# EAGLE design system (EAGLE 9.6.2)
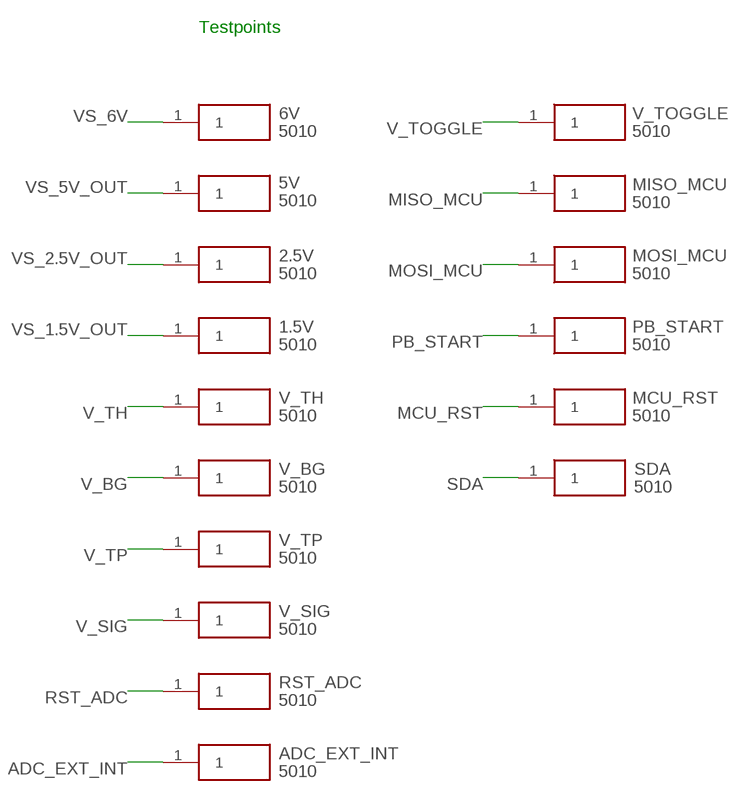
[diagram p0: schematic, sheet 1, part 1 of 2]
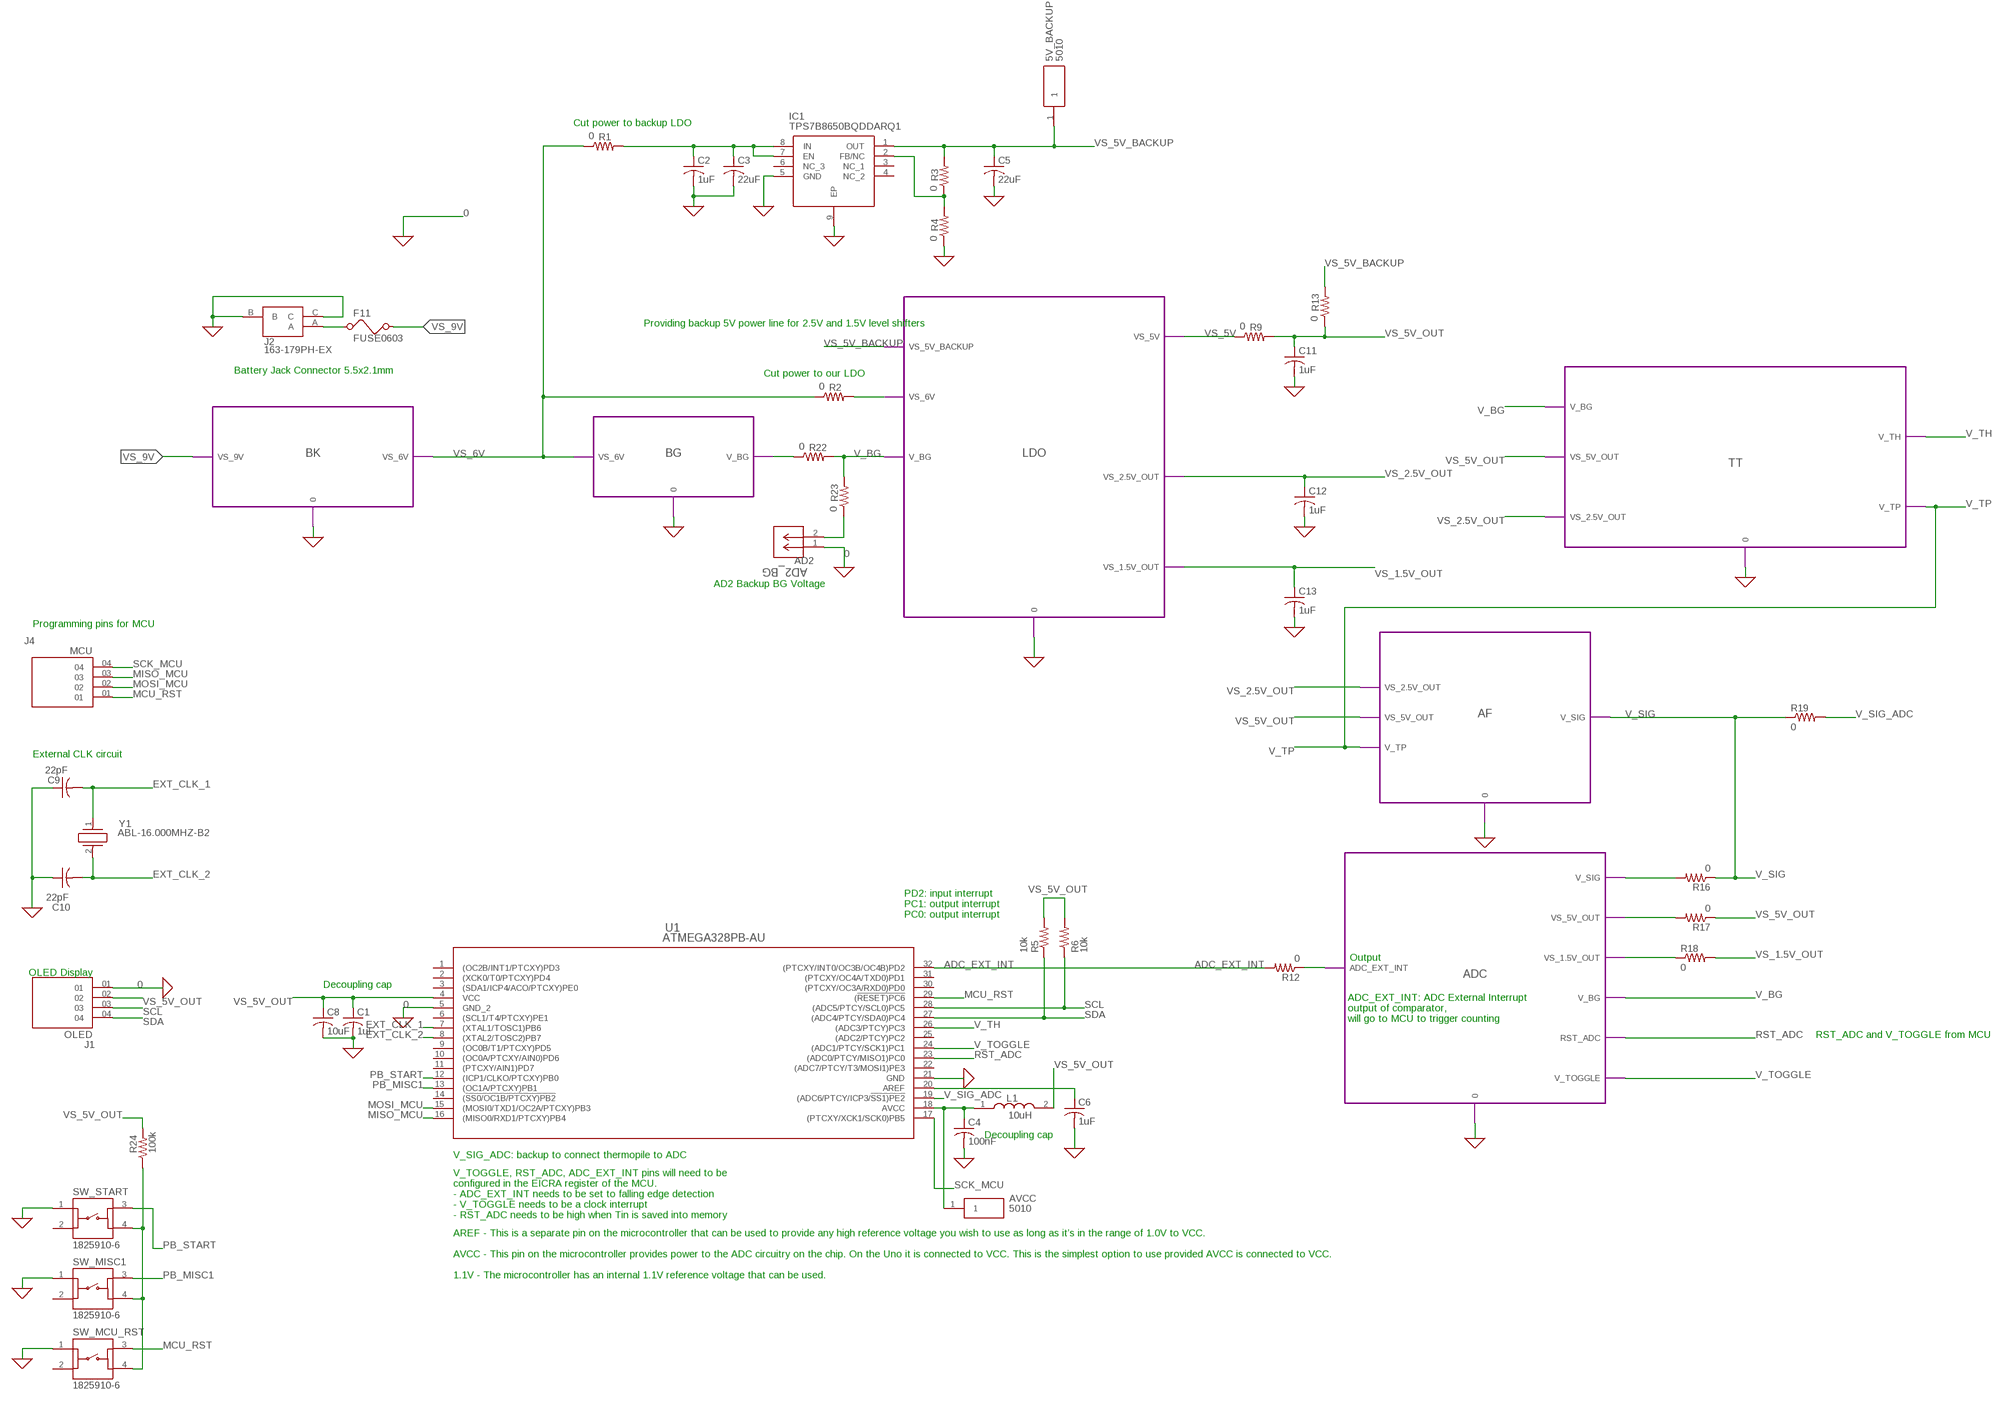
[diagram p1: schematic, sheet 1, part 2 of 2]

## Parts
1.5V  5010  [5010]
2.5V  5010  [5010]
5V  5010  [5010]
5V_BACKUP  5010  [5010]
6V  5010  [5010]
AD2_BG  AD2_BG  RS1-02-G  [CONN_RS1-02-G_ADM]
ADC_EXT_INT  5010  [5010]
AVCC  5010  [5010]
C1  1uF  C-USC0603  [C0603]
C2  1uF  C-USC0603  [C0603]
C3  22uF  C-USC0603  [C0603]
C4  100nF  C-USC0603  [C0603]
C5  22uF  C-USC0603  [C0603]
C6  1uF  C-USC0603  [C0603]
C8  10uF  C-USC0603  [C0603]
C9  22pF  C-USC0603  [C0603]
C10  22pF  C-USC0603  [C0603]
C11  1uF  C-USC0603  [C0603]
C12  1uF  C-USC0603  [C0603]
C13  1uF  C-USC0603  [C0603]
F11  FUSE0603  [R0603]
IC1  TPS7B8650BQDDARQ1  [SOIC127P600X170-9N]
J1  OLED  TSW-104-07-F-S  [SAMTEC_TSW-104-07-F-S]
J2  163-179PH-EX  [163179PHEX]
J4  MCU  TSW-104-07-F-S  [SAMTEC_TSW-104-07-F-S]
L1  10uH  SRP1038CC-100M  [INDPM110100X400N]
MCU_RST  5010  [5010]
MISO_MCU  5010  [5010]
MOSI_MCU  5010  [5010]
PB_START  5010  [5010]
R1  0  R-US_R0603  [R0603]
R2  0  R-US_R0603  [R0603]
R3  0  R-US_R0603  [R0603]
R4  0  R-US_R0603  [R0603]
R5  10k  R-US_R0603  [R0603]
R6  10k  R-US_R0603  [R0603]
R9  0  R-US_R0603  [R0603]
R12  0  R-US_R0603  [R0603]
R13  0  R-US_R0603  [R0603]
R16  0  R-US_R0603  [R0603]
R17  0  R-US_R0603  [R0603]
R18  0  R-US_R0603  [R0603]
R19  0  R-US_R0603  [R0603]
R22  0  R-US_R0603  [R0603]
R23  0  R-US_R0603  [R0603]
R24  100k  R-US_R0603  [R0603]
RST_ADC  5010  [5010]
SDA  5010  [5010]
SW_MCU_RST  1825910-6  [SW_1825910-6-4]
SW_MISC1  1825910-6  [SW_1825910-6-4]
SW_START  1825910-6  [SW_1825910-6-4]
U1  ATMEGA328PB-AU  [32A_MCH]
V_BG  5010  [5010]
V_SIG  5010  [5010]
V_TH  5010  [5010]
V_TOGGLE  5010  [5010]
V_TP  5010  [5010]
Y1  ABL-16.000MHZ-B2  [ABL]

## Module instances
BK = BATTERY_AND_BUCK
LDO = LDO_AND_VOLTAGE_REFS
BG = BANDGAP_REF
TT = THERMISTOR_THERMOPILE
AF = AMP_AND_FILTER
ADC = DUAL_SLOPE_ADC

## Nets
0: AD2_BG.1 C1.2 C2.2 C3.2 C4.2 C5.2 C6.2 C8.2 C9.1 C10.1 C11.2 C12.2 C13.2 IC1.5(GND) IC1.9(EP) J1.01 J2.B J2.C R4.1 SW_MCU_RST.1 SW_MISC1.1 SW_START.1 U1.5(GND_2) U1.21(GND) ; port TT.0 AF.0 ADC.0 BG.0 BK.0 LDO.0 ; supply symbol labelled GND
ADC_EXT_INT: ADC_EXT_INT.1 R12.2 U1.32((PTCXY/INT0/OC3B/OC4B)PD2)
EXT_CLK_1: C9.2 U1.7((XTAL1/TOSC1)PB6) Y1.1
EXT_CLK_2: C10.2 U1.8((XTAL2/TOSC2)PB7) Y1.2
MCU_RST: J4.01 MCU_RST.1 SW_MCU_RST.3 U1.29((!RESET)PC6)
MISO_MCU: J4.03 MISO_MCU.1 U1.16((MISO0/RXD1/PTCXY)PB4)
MOSI_MCU: J4.02 MOSI_MCU.1 U1.15((MOSI0/TXD1/OC2A/PTCXY)PB3)
N$1: R2.2 ; port LDO.VS_6V
N$2: R16.2 ; port ADC.V_SIG
N$3: F11.1 J2.A
N$4: AVCC.1 C4.1 L1.1 U1.18(AVCC)
N$5: R18.1 ; port ADC.VS_1.5V_OUT
N$6: R17.2 ; port ADC.VS_5V_OUT
N$7: R22.1 ; port BG.V_BG
N$9: C2.1 C3.1 IC1.7(EN) IC1.8(IN) R1.2
N$10: IC1.2(FB/NC) R3.1 R4.2
N$11: AD2_BG.2 R23.1
N$14: R12.1 ; port ADC.ADC_EXT_INT
N$15: C6.1 U1.20(AREF)
N$19: R24.1 SW_MCU_RST.4 SW_MISC1.4 SW_START.4
PB_MISC1: SW_MISC1.3 U1.13((OC1A/PTCXY)PB1)
PB_START: PB_START.1 SW_START.3 U1.12((ICP1/CLKO/PTCXY)PB0)
RST_ADC: RST_ADC.1 U1.23((ADC0/PTCY/MISO1)PC0) ; port ADC.RST_ADC
SCK_MCU: J4.04 U1.17((PTCXY/XCK1/SCK0)PB5)
SCL: J1.03 R6.1 U1.28((ADC5/PTCY/SCL0)PC5)
SDA: J1.04 R5.1 SDA.1 U1.27((ADC4/PTCY/SDA0)PC4)
V_BG: R22.2 R23.2 V_BG.1 ; port LDO.V_BG TT.V_BG ADC.V_BG
V_SIG: R16.1 R19.1 V_SIG.1 ; port AF.V_SIG
V_SIG_ADC: R19.2 U1.19((ADC6/PTCY/ICP3/!SS1)PE2)
V_TH: U1.26((ADC3/PTCY)PC3) V_TH.1 ; port TT.V_TH
V_TOGGLE: U1.24((ADC1/PTCY/SCK1)PC1) V_TOGGLE.1 ; port ADC.V_TOGGLE
V_TP: V_TP.1 ; port AF.V_TP TT.V_TP
VS_1.5V_OUT: 1.5V.1 C13.1 R18.2 ; port LDO.VS_1.5V_OUT
VS_2.5V_OUT: 2.5V.1 C12.1 ; port LDO.VS_2.5V_OUT AF.VS_2.5V_OUT TT.VS_2.5V_OUT
VS_5V: R9.1 ; port LDO.VS_5V
VS_5V_BACKUP: 5V_BACKUP.1 C5.1 IC1.1(OUT) R3.2 R13.2 ; port LDO.VS_5V_BACKUP
VS_5V_OUT: 5V.1 C1.1 C8.1 C11.1 J1.02 L1.2 R5.2 R6.2 R9.2 R13.1 R17.1 R24.2 U1.4(VCC) ; port AF.VS_5V_OUT TT.VS_5V_OUT
VS_6V: 6V.1 R1.1 R2.1 ; port BK.VS_6V BG.VS_6V
VS_9V: F11.2 ; port BK.VS_9V
Unconnected: IC1.3(NC_1) IC1.4(NC_2) IC1.6(NC_3) SW_MCU_RST.2 SW_MISC1.2 SW_START.2 U1.1((OC2B/INT1/PTCXY)PD3) U1.2((XCK0/T0/PTCXY)PD4) U1.3((SDA1/ICP4/ACO/PTCXY)PE0) U1.6((SCL1/T4/PTCXY)PE1) U1.9((OC0B/T1/PTCXY)PD5) U1.10((OC0A/PTCXY/AIN0)PD6) U1.11((PTCXY/AIN1)PD7) U1.14((!SS0/OC1B/PTCXY)PB2) U1.22((ADC7/PTCY/T3/MOSI1)PE3) U1.25((ADC2/PTCY)PC2) U1.30((PTCXY/OC3A/RXD0)PD0) U1.31((PTCXY/OC4A/TXD0)PD1)

## Notes on the sheet
- Cut power to backup LDO
- Providing backup 5V power line for 2.5V and 1.5V level shifters
- Battery Jack Connector 5.5x2.1mm
- Cut power to our LDO
- AD2 Backup BG Voltage
- Programming pins for MCU
- Testpoints
- External CLK circuit
- PD2: input interrupt 
  PC1: output interrupt
  PC0: output interrupt
- Output
- OLED Display
- Decoupling cap
- ADC_EXT_INT: ADC External Interrupt
  output of comparator, 
  will go to MCU to trigger counting
- RST_ADC and V_TOGGLE from MCU
- Decoupling cap
- V_SIG_ADC: backup to connect thermopile to ADC
- V_TOGGLE, RST_ADC, ADC_EXT_INT pins will need to be 
  configured in the EICRA register of the MCU. 
  - ADC_EXT_INT needs to be set to falling edge detection
  - V_TOGGLE needs to be a clock interrupt
  - RST_ADC needs to be high when Tin is saved into memory
- AREF - This is a separate pin on the microcontroller that can be used to provide any high reference voltage you wish to use as long as it’s in the range of 1.0V to VCC. 
  
  AVCC - This pin on the microcontroller provides power to the ADC circuitry on the chip. On the Uno it is connected to VCC. This is the simplest option to use provided AVCC is connected to VCC. 
  
  1.1V - The microcontroller has an internal 1.1V reference voltage that can be used.

## Library data of the parts
1.5V 2.5V 5V 5V_BACKUP 6V ADC_EXT_INT AVCC MCU_RST MISO_MCU MOSI_MCU PB_START RST_ADC SDA V_BG V_SIG V_TH V_TOGGLE V_TP = 5010:5010: KEYSTONE - 5010 - TEST POINT, PCB, THROUGH HOLE Source: Datasheet; DESCRIPTION: KEYSTONE - 5010 - TEST POINT, PCB, THROUGH HOLE; HEIGHT: 8.28mm; MANUFACTURER_NAME: Keystone Electronics; MANUFACTURER_PART_NUMBER: 5010; MOUSER_PART_NUMBER: 534-5010; MOUSER_PRICE-STOCK: https://www.mouser.co.uk/ProductDetail/Keystone-Electronics/5010?qs=qOqV1E1P08SzD%252BWfk1wMXQ%3D%3D
AD2_BG = RS1-02-G:RS1-02-G; AD2: AD2; COPYRIGHT: Copyright (C) 2024 Ultra Librarian. All rights reserved.; MANUFACTURER_PART_NUMBER: RS1-02-G; MFR_NAME: ADAM TECHNOLOGIES INC
C1-C6 C8-C13 = rcl:C-US: CAPACITOR, American symbol; SPICEPREFIX: C
F11 = Fuse_Custom:FUSE0603
IC1 = TPS7B8650BQDDARQ1:TPS7B8650BQDDARQ1: LDO Voltage Regulators Automotive 500-mA, 40-V, ultra-low-IQ, low-dropout (LDO) linear regulator with power good 8-SO PowerPAD -40 to 150 Source: Datasheet <https://www.ti.com/lit/gpn/tps7b86-q1?HQS=ti-null-null-sf-df-pf-sep-wwe&DCM=yes?hkey=EF798316E3902B6ED9A73243A3159BB0>; DESCRIPTION: LDO Voltage Regulators Automotive 500-mA, 40-V, ultra-low-IQ, low-dropout (LDO) linear regulator with power good 8-SO PowerPAD -40 to 150; HEIGHT: 1.7mm; MANUFACTURER_NAME: Texas Instruments; MANUFACTURER_PART_NUMBER: TPS7B8650BQDDARQ1; MOUSER_PART_NUMBER: 595-PS7B8650BQDDARQ1; MOUSER_PRICE-STOCK: https://www.mouser.co.uk/ProductDetail/Texas-Instruments/TPS7B8650BQDDARQ1?qs=ulEaXIWI0c8l2EN1AjsVkA%3D%3D
J1 J4 = TSW-104-07-F-S:TSW-104-07-F-S; MANUFACTURER: Samtec; PARTREV: R; STANDARD: Manufacturer Recommendations
J2 = 163-179PH-EX:163-179PH-EX: DC Power Connectors PCB 2.1MM Source: Datasheet <https://componentsearchengine.com/Datasheets/1/163-179PH-EX.pdf>; DESCRIPTION: DC Power Connectors PCB 2.1MM; HEIGHT: 11mm; MANUFACTURER_NAME: Kobiconn; MANUFACTURER_PART_NUMBER: 163-179PH-EX; MOUSER_PART_NUMBER: 163-179PH-EX; MOUSER_PRICE-STOCK: https://www.mouser.co.uk/ProductDetail/Kobiconn/163-179PH-EX?qs=Xb8IjHhkxj5l2UOaIqcGCw%3D%3D
L1 = SRP1038CC-100M:SRP1038CC-100M: Ind,11x10x3.8mm,10uH+/-20%,8.5A,shd Source: Datasheet <https://www.bourns.com/docs/Product-Datasheets/SRP1038CC.pdf>; DESCRIPTION: Ind,11x10x3.8mm,10uH+/-20%,8.5A,shd; HEIGHT: 4mm; MANUFACTURER_NAME: Bourns; MANUFACTURER_PART_NUMBER: SRP1038CC-100M; MOUSER_PART_NUMBER: 652-SRP1038CC-100M; MOUSER_PRICE-STOCK: https://www.mouser.co.uk/ProductDetail/Bourns/SRP1038CC-100M?qs=1Kr7Jg1SGW%252BXHFZ7Gpw7DQ%3D%3D
R1-R6 R9 R12 R13 R16-R19 R22-R24 = rcl:R-US_: RESISTOR, American symbol; SPICEPREFIX: R
SW_MCU_RST SW_MISC1 SW_START = 1825910-6:1825910-6: Switch Tactile OFF (ON) SPST Round Button PC Pins 0.05A 24VDC 100000Cycles 1.57N Thru-Hole Loose Check availability <https://pricing.snapeda.com/parts/1825910-6/TE%20Connectivity/view-part?ref=eda>; AVAILABILITY: In Stock; CHECK_PRICES: https://www.snapeda.com/parts/1825910-6/TE+Connectivity+ALCOSWITCH+Switches/view-part/?ref=eda; COMMENT: 1825910-6; DESCRIPTION: Switch Push Button OFF (ON) SPST Round Button 0.05A 24VDC Momentary Contact PC Pins Thru-Hole; MF: TE Connectivity; MP: 1825910-6; PACKAGE: None; PRICE: None; SNAPEDA_LINK: https://www.snapeda.com/parts/1825910-6/TE+Connectivity+ALCOSWITCH+Switches/view-part/?ref=snap
U1 = ATMEGA328PB_AU32A:ATMEGA328PB-AU; COPYRIGHT: Copyright (C) 2024 Ultra Librarian. All rights reserved.; MANUFACTURER_PART_NUMBER: ATMEGA328PB-AU; MFR_NAME: Microchip
Y1 = ABL-16.000MHZ-B2:ABL-16.000MHZ-B2: ABRACON - ABL-16.000MHZ-B2 - CRYSTAL Source: Datasheet <https://abracon.com/Resonators/ABL.pdf>; DESCRIPTION: ABRACON - ABL-16.000MHZ-B2 - CRYSTAL; HEIGHT: mm; MANUFACTURER_NAME: ABRACON; MANUFACTURER_PART_NUMBER: ABL-16.000MHZ-B2; MOUSER_PART_NUMBER: 815-ABL-16-B2; MOUSER_PRICE-STOCK: https://www.mouser.co.uk/ProductDetail/ABRACON/ABL-16.000MHZ-B2?qs=A7YjigRBFZlH19Ss3q%252BAbA%3D%3D

## Module BATTERY_AND_BUCK
Ports: VS_6V(io) VS_9V(io) 0(io)
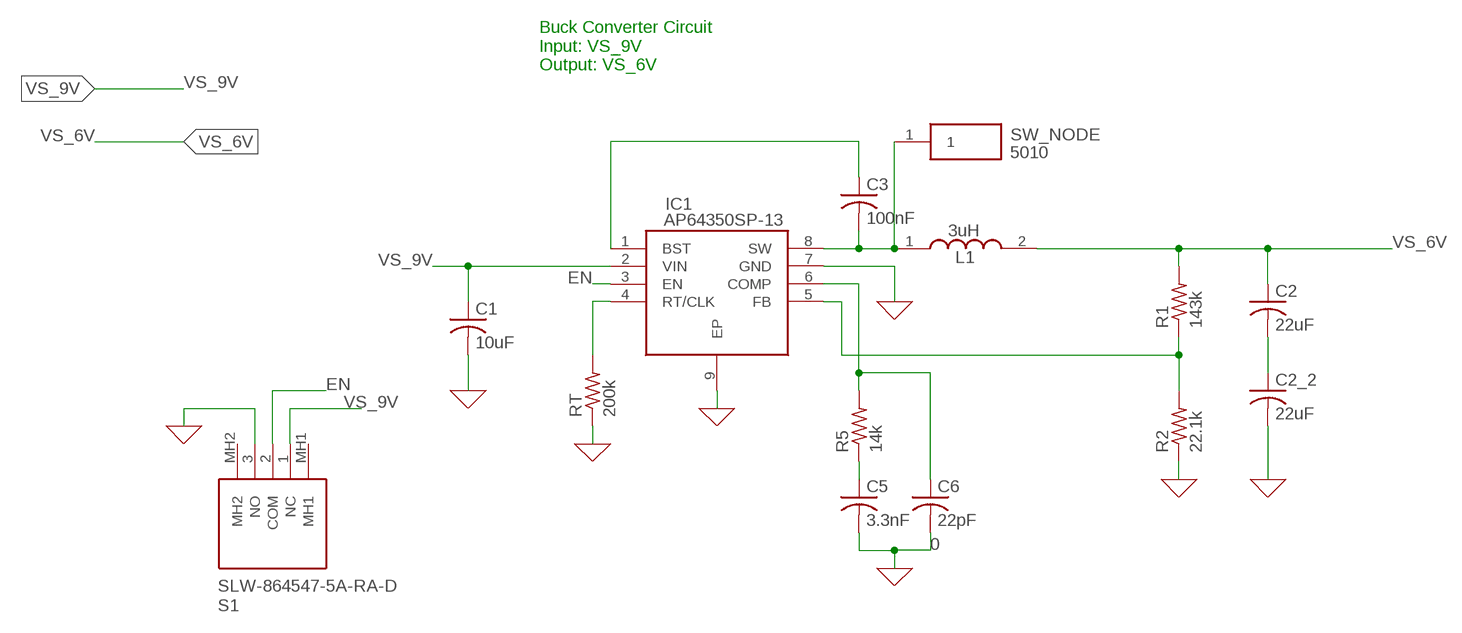
[diagram p2: schematic, module BATTERY_AND_BUCK, sheet 1]

### Parts
C1  10uF  C-USC0603  [C0603]
C2  22uF  C-USC0603  [C0603]
C2_2  22uF  C-USC0603  [C0603]
C3  100nF  C-USC0603  [C0603]
C5  3.3nF  C-USC0603  [C0603]
C6  22pF  C-USC0603  [C0603]
IC1  AP64350SP-13  [SOIC127P600X163-9N]
L1  3uH  744053003  [WE-TPC_5818/582892]
R1  143k  R-US_R0603  [R0603]
R2  22.1k  R-US_R0603  [R0603]
R5  14k  R-US_R0603  [R0603]
RT  200k  R-US_R0603  [R0603]
S1  SLW-864547-5A-RA-D  [SLW8645475ARAD]
SW_NODE  5010  [5010]

### Nets
0: C1.2 C2_2.2 C5.2 C6.2 IC1.7(GND) IC1.9(EP) R2.1 RT.1 S1.3(NO) ; supply symbol labelled GND
EN: IC1.3(EN) S1.2(COM)
N$1: IC1.4(RT/CLK) RT.2
N$2: C3.2 IC1.8(SW) L1.1 SW_NODE.1
N$3: C3.1 IC1.1(BST)
N$4: C2.2 C2_2.1
N$5: C6.1 IC1.6(COMP) R5.2
N$6: IC1.5(FB) R1.1 R2.2
N$7: C5.1 R5.1
VS_6V: C2.1 L1.2 R1.2
VS_9V: C1.1 IC1.2(VIN) S1.1(NC)
Unconnected: S1.MH1 S1.MH2

### Notes on the sheet
- Buck Converter Circuit
  Input: VS_9V
  Output: VS_6V

### Library data of the parts
C1 C2 C2_2 C3 C5 C6 = rcl:C-US: CAPACITOR, American symbol; SPICEPREFIX: C
IC1 = AP64350SP-13:AP64350SP-13: Switching Voltage Regulators 3.8V-40V 3.5A LOW IQ SYN BUCK PRG SW FRQ Source: Datasheet <https://www.diodes.com//assets/Datasheets/AP64350.pdf>; DESCRIPTION: Switching Voltage Regulators 3.8V-40V 3.5A LOW IQ SYN BUCK PRG SW FRQ; HEIGHT: 1.63mm; MANUFACTURER_NAME: Diodes Incorporated; MANUFACTURER_PART_NUMBER: AP64350SP-13; MOUSER_PART_NUMBER: 621-AP64350SP-13; MOUSER_PRICE-STOCK: https://www.mouser.co.uk/ProductDetail/Diodes-Incorporated/AP64350SP-13?qs=P1JMDcb91o71f8WTy9mMPQ%3D%3D
L1 = 744053003:744053003: Wurth Shielded Wire-wound SMD Inductor with a Ferrite Core, 3 uH +/-30% 2.8A Idc Source: Datasheet <https://componentsearchengine.com/Datasheets/1/744053003.pdf>; DESCRIPTION: Wurth Shielded Wire-wound SMD Inductor with a Ferrite Core, 3 uH +/-30% 2.8A Idc; HEIGHT: mm; MANUFACTURER_NAME: Wurth Elektronik; MANUFACTURER_PART_NUMBER: 744053003; MOUSER_PART_NUMBER: 710-744053003; MOUSER_PRICE-STOCK: https://www.mouser.com/Search/Refine.aspx?Keyword=710-744053003
R1 R2 R5 RT = rcl:R-US_: RESISTOR, American symbol; SPICEPREFIX: R
S1 = SLW-864547-5A-RA-D:SLW-864547-5A-RA-D: 8.6 x 4.5 x 4.7 mm, 5 mm Raised Slide Actuator, Right Angle, Through Hole, Slide Switch Source: Datasheet <https://www.cuidevices.com/product/resource/slw-864547-5a-ra-d.pdf>; DESCRIPTION: 8.6 x 4.5 x 4.7 mm, 5 mm Raised Slide Actuator, Right Angle, Through Hole, Slide Switch; HEIGHT: 4.9mm; MANUFACTURER_NAME: CUI Devices; MANUFACTURER_PART_NUMBER: SLW-864547-5A-RA-D; MOUSER_PART_NUMBER: 179-SLW-864547-5ARAD; MOUSER_PRICE-STOCK: https://www.mouser.co.uk/ProductDetail/CUI-Devices/SLW-864547-5A-RA-D?qs=1Kr7Jg1SGW%252Bn%2FarYZIP3WQ%3D%3D
SW_NODE = 5010:5010: KEYSTONE - 5010 - TEST POINT, PCB, THROUGH HOLE Source: Datasheet; DESCRIPTION: KEYSTONE - 5010 - TEST POINT, PCB, THROUGH HOLE; HEIGHT: 8.28mm; MANUFACTURER_NAME: Keystone Electronics; MANUFACTURER_PART_NUMBER: 5010; MOUSER_PART_NUMBER: 534-5010; MOUSER_PRICE-STOCK: https://www.mouser.co.uk/ProductDetail/Keystone-Electronics/5010?qs=qOqV1E1P08SzD%252BWfk1wMXQ%3D%3D

## Module LDO_AND_VOLTAGE_REFS
Ports: VS_6V(io) V_BG(io) VS_5V(io) VS_5V_BACKUP(io) VS_2.5V_OUT(io) VS_1.5V_OUT(io) 0(io)
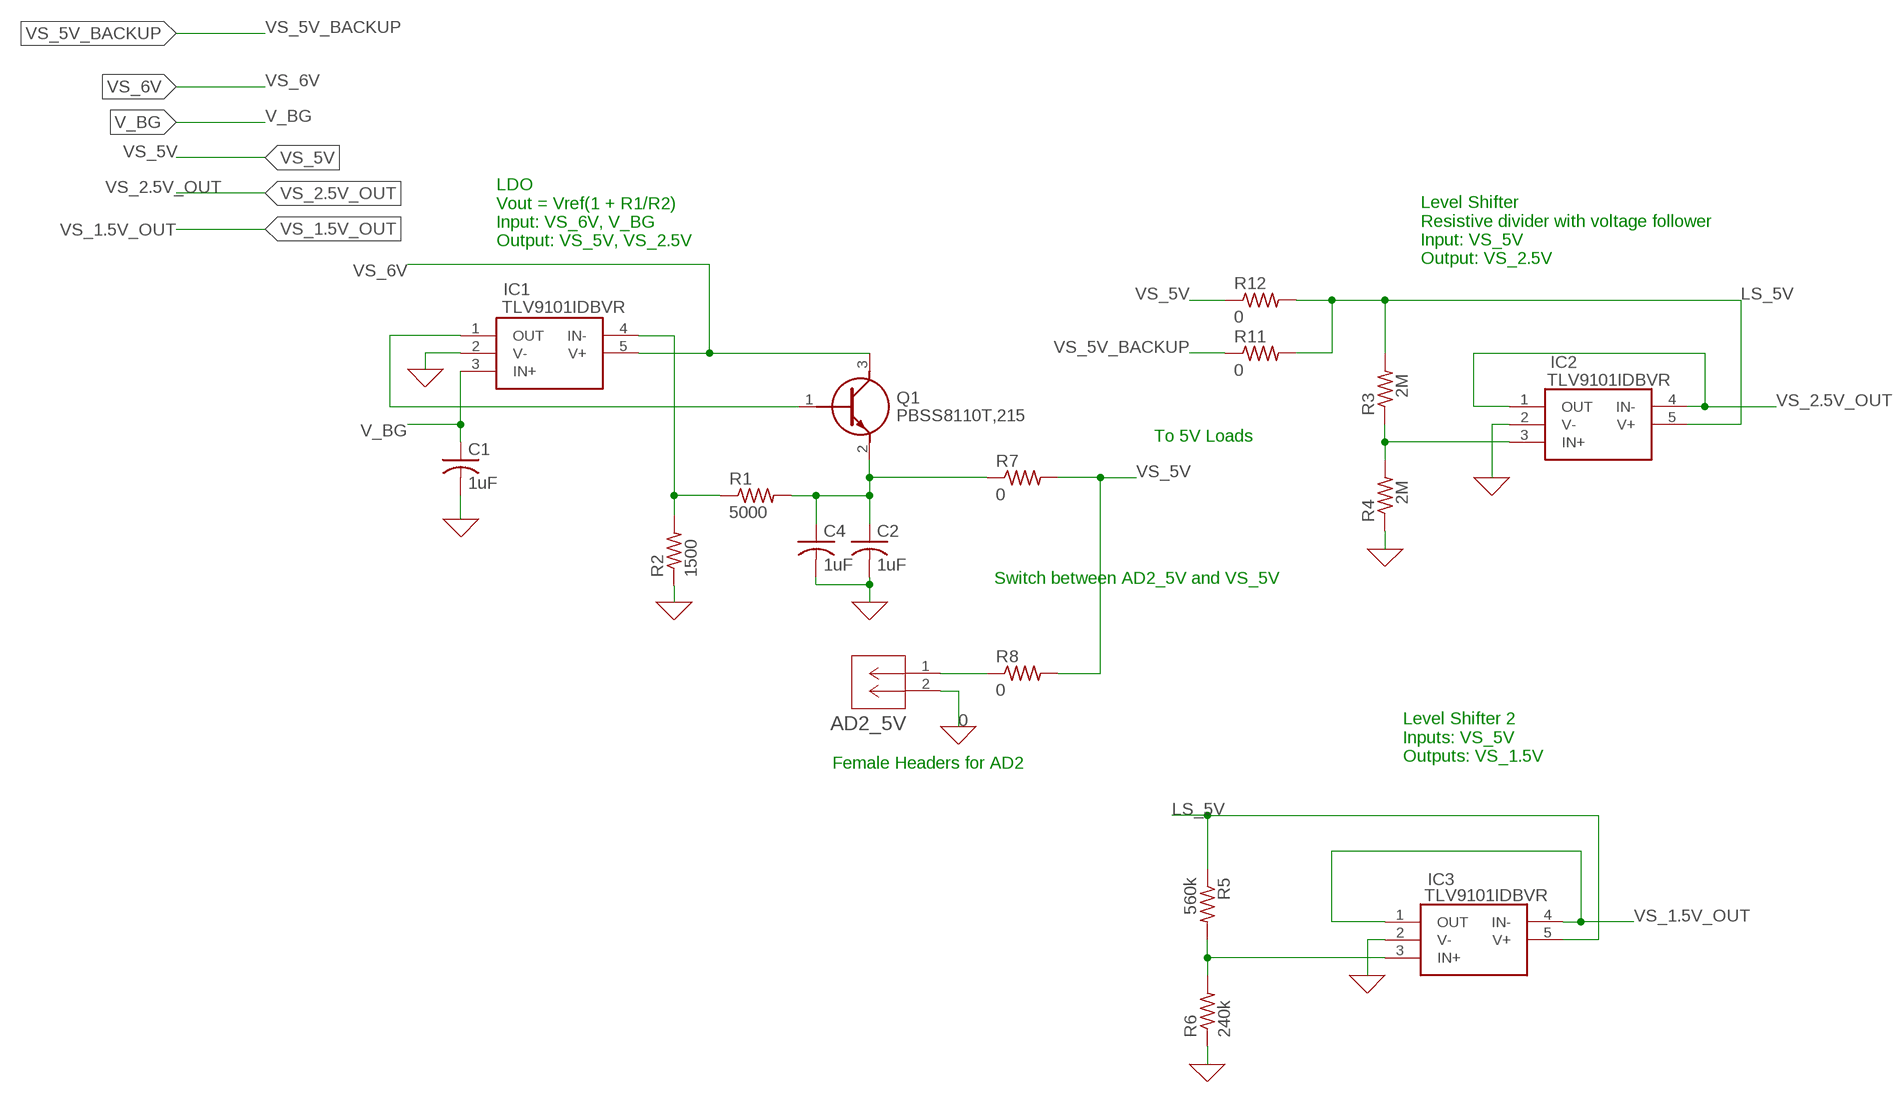
[diagram p3: schematic, module LDO_AND_VOLTAGE_REFS, sheet 1]

### Parts
AD2_5V  RS1-02-G  [CONN_RS1-02-G_ADM]
C1  1uF  C-USC0603  [C0603]
C2  1uF  C-USC0603  [C0603]
C4  1uF  C-USC0603  [C0603]
IC1  TLV9101IDBVR  [SOT95P280X145-5N]
IC2  TLV9101IDBVR  [SOT95P280X145-5N]
IC3  TLV9101IDBVR  [SOT95P280X145-5N]
Q1  PBSS8110T,215  [SOT95P230X110-3N]
R1  5000  R-US_R0603  [R0603]
R2  1500  R-US_R0603  [R0603]
R3  2M  R-US_R0603  [R0603]
R4  2M  R-US_R0603  [R0603]
R5  560k  R-US_R0603  [R0603]
R6  240k  R-US_R0603  [R0603]
R7  0  R-US_R0603  [R0603]
R8  0  R-US_R0603  [R0603]
R11  0  R-US_R0603  [R0603]
R12  0  R-US_R0603  [R0603]

### Nets
0: AD2_5V.2 C1.2 C2.2 C4.2 IC1.2(V-) IC2.2(V-) IC3.2(V-) R2.1 R4.1 R6.1 ; supply symbol labelled GND
LS_5V: IC2.5(V+) IC3.5(V+) R3.2 R5.1 R11.2 R12.2
N$1: IC1.4(IN-) R1.1 R2.2
N$2: IC2.3(IN+) R3.1 R4.2
N$3: AD2_5V.1 R8.1
N$4: IC1.1(OUT) Q1.1(B)
N$5: C2.1 C4.1 Q1.2(E) R1.2 R7.1
N$6: IC3.3(IN+) R5.2 R6.2
V_BG: C1.1 IC1.3(IN+)
VS_1.5V_OUT: IC3.1(OUT) IC3.4(IN-)
VS_2.5V_OUT: IC2.1(OUT) IC2.4(IN-)
VS_5V: R7.2 R8.2 R12.1
VS_5V_BACKUP: R11.1
VS_6V: IC1.5(V+) Q1.3(C)

### Notes on the sheet
- LDO
  Vout = Vref(1 + R1/R2)
  Input: VS_6V, V_BG
  Output: VS_5V, VS_2.5V
- Level Shifter
  Resistive divider with voltage follower
  Input: VS_5V
  Output: VS_2.5V
- To 5V Loads
- Switch between AD2_5V and VS_5V
- Level Shifter 2
  Inputs: VS_5V
  Outputs: VS_1.5V
- Female Headers for AD2

### Library data of the parts
AD2_5V = RS1-02-G:RS1-02-G; COPYRIGHT: Copyright (C) 2024 Ultra Librarian. All rights reserved.; MANUFACTURER_PART_NUMBER: RS1-02-G; MFR_NAME: ADAM TECHNOLOGIES INC
C1 C2 C4 = rcl:C-US: CAPACITOR, American symbol; SPICEPREFIX: C
IC1-IC3 = TLV9101IDBVR:TLV9101IDBVR: Single 1MHz, 16-V rail-to-rail input/output, low-offset voltage, low-power op amp Source: Datasheet <http://www.ti.com/lit/ds/symlink/tlv9101.pdf>; DESCRIPTION: Single 1MHz, 16-V rail-to-rail input/output, low-offset voltage, low-power op amp; HEIGHT: 1.45mm; MANUFACTURER_NAME: Texas Instruments; MANUFACTURER_PART_NUMBER: TLV9101IDBVR; MOUSER_PART_NUMBER: 595-TLV9101IDBVR; MOUSER_PRICE-STOCK: https://www.mouser.co.uk/ProductDetail/Texas-Instruments/TLV9101IDBVR?qs=P1JMDcb91o6ZLUyc%2FHtrGA%3D%3D
Q1 = PBSS8110T_215:PBSS8110T,215: PBSS8110T - 100 V, 1 A NPN low VCEsat (BISS) transistor Source: Datasheet <https://assets.nexperia.com/documents/data-sheet/PBSS8110T.pdf>; DESCRIPTION: PBSS8110T - 100 V, 1 A NPN low VCEsat (BISS) transistor; HEIGHT: 1.1mm; MANUFACTURER_NAME: Nexperia; MANUFACTURER_PART_NUMBER: PBSS8110T,215; MOUSER_PART_NUMBER: 771-PBSS8110TT/R; MOUSER_PRICE-STOCK: https://www.mouser.co.uk/ProductDetail/Nexperia/PBSS8110T215?qs=LOCUfHb8d9vZny%252BDp6HU1g%3D%3D
R1-R8 R11 R12 = rcl:R-US_: RESISTOR, American symbol; SPICEPREFIX: R

## Module BANDGAP_REF
Ports: VS_6V(io) V_BG(io) 0(io)
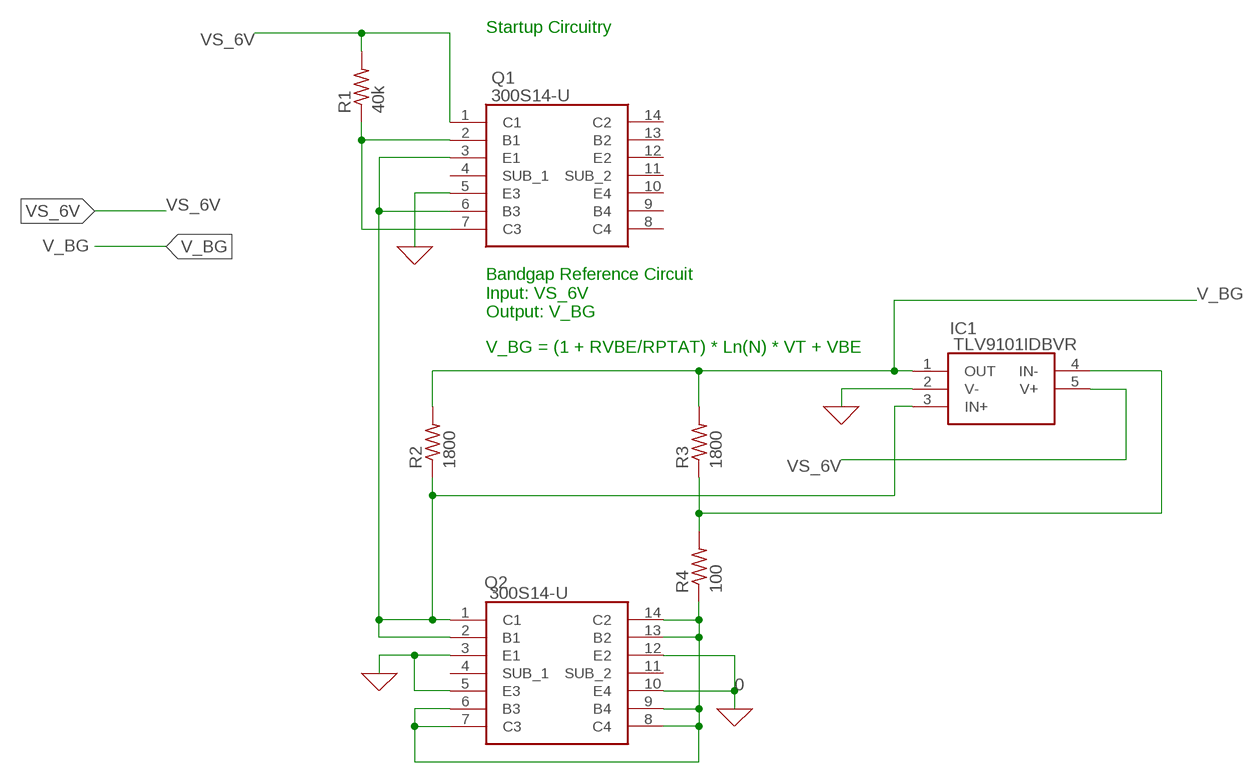
[diagram p4: schematic, module BANDGAP_REF, sheet 1]

### Parts
IC1  TLV9101IDBVR  [SOT95P280X145-5N]
Q1  300S14-U  [SOIC127P602X175-14N]
Q2  300S14-U  [SOIC127P602X175-14N]
R1  40k  R-US_R0603  [R0603]
R2  1800  R-US_R0603  [R0603]
R3  1800  R-US_R0603  [R0603]
R4  100  R-US_R0603  [R0603]

### Nets
0: IC1.2(V-) Q1.5(E3) Q2.3(E1) Q2.5(E3) Q2.10(E4) Q2.12(E2) ; supply symbol labelled GND
N$1: Q1.2(B1) Q1.7(C3) R1.1
N$2: IC1.3(IN+) Q1.3(E1) Q1.6(B3) Q2.1(C1) Q2.2(B1) R2.1
N$4: IC1.4(IN-) R3.1 R4.2
N$5: Q2.6(B3) Q2.7(C3) Q2.8(C4) Q2.9(B4) Q2.13(B2) Q2.14(C2) R4.1
V_BG: IC1.1(OUT) R2.2 R3.2
VS_6V: IC1.5(V+) Q1.1(C1) R1.2
Unconnected: Q1.4(SUB_1) Q1.8(C4) Q1.9(B4) Q1.10(E4) Q1.11(SUB_2) Q1.12(E2) Q1.13(B2) Q1.14(C2) Q2.4(SUB_1) Q2.11(SUB_2)

### Notes on the sheet
- Startup Circuitry
- Bandgap Reference Circuit
  Input: VS_6V
  Output: V_BG
- V_BG = (1 + RVBE/RPTAT) * Ln(N) * VT + VBE

### Library data of the parts
IC1 = TLV9101IDBVR:TLV9101IDBVR: Single 1MHz, 16-V rail-to-rail input/output, low-offset voltage, low-power op amp Source: Datasheet <http://www.ti.com/lit/ds/symlink/tlv9101.pdf>; DESCRIPTION: Single 1MHz, 16-V rail-to-rail input/output, low-offset voltage, low-power op amp; HEIGHT: 1.45mm; MANUFACTURER_NAME: Texas Instruments; MANUFACTURER_PART_NUMBER: TLV9101IDBVR; MOUSER_PART_NUMBER: 595-TLV9101IDBVR; MOUSER_PRICE-STOCK: https://www.mouser.co.uk/ProductDetail/Texas-Instruments/TLV9101IDBVR?qs=P1JMDcb91o6ZLUyc%2FHtrGA%3D%3D
Q1 Q2 = 300S14-U:300S14-U: Bipolar Transistors - BJT 4 NPN Matched Trans. Array SO-14 Source: Datasheet; DESCRIPTION: Bipolar Transistors - BJT 4 NPN Matched Trans. Array SO-14; HEIGHT: 1.75mm; MANUFACTURER_NAME: THAT CORPORATION; MANUFACTURER_PART_NUMBER: 300S14-U; MOUSER_PART_NUMBER: 887-300S14-U; MOUSER_PRICE-STOCK: https://www.mouser.co.uk/ProductDetail/THAT/300S14-U?qs=wN%2Fcur4AVWdHgHcGlLafqA%3D%3D
R1-R4 = rcl:R-US_: RESISTOR, American symbol; SPICEPREFIX: R

## Module THERMISTOR_THERMOPILE
Ports: V_BG(io) V_TH(io) V_TP(io) VS_5V_OUT(io) VS_2.5V_OUT(io) 0(io)
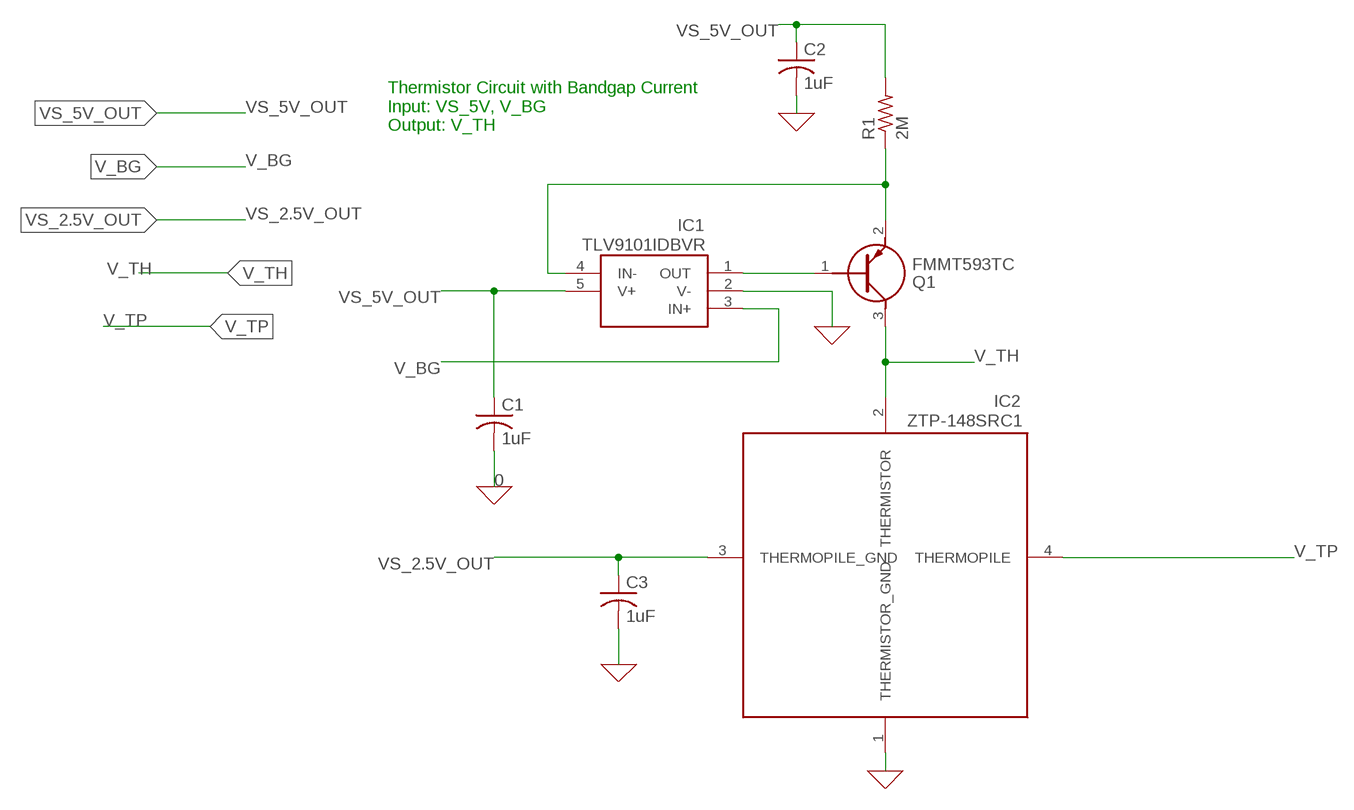
[diagram p5: schematic, module THERMISTOR_THERMOPILE, sheet 1]

### Parts
C1  1uF  C-USC0603  [C0603]
C2  1uF  C-USC0603  [C0603]
C3  1uF  C-USC0603  [C0603]
IC1  TLV9101IDBVR  [SOT95P280X145-5N]
IC2  ZTP-148SRC1  [ZTP148SRC1]
Q1  FMMT593TC  [SOT95P237X112-3N]
R1  2M  R-US_R0603  [R0603]

### Nets
0: C1.2 C2.2 C3.2 IC1.2(V-) IC2.1(THERMISTOR_GND) ; supply symbol labelled GND
N$1: IC1.1(OUT) Q1.1(B)
N$3: IC1.4(IN-) Q1.2(E) R1.1
V_BG: IC1.3(IN+)
V_TH: IC2.2(THERMISTOR) Q1.3(C)
V_TP: IC2.4(THERMOPILE)
VS_2.5V_OUT: C3.1 IC2.3(THERMOPILE_GND)
VS_5V_OUT: C1.1 C2.1 IC1.5(V+) R1.2

### Notes on the sheet
- Thermistor Circuit with Bandgap Current
  Input: VS_5V, V_BG
  Output: V_TH

### Library data of the parts
C1-C3 = resistor:C-US: CAPACITOR, American symbol
IC1 = TLV9101IDBVR:TLV9101IDBVR: Single 1MHz, 16-V rail-to-rail input/output, low-offset voltage, low-power op amp Source: Datasheet <http://www.ti.com/lit/ds/symlink/tlv9101.pdf>; DESCRIPTION: Single 1MHz, 16-V rail-to-rail input/output, low-offset voltage, low-power op amp; HEIGHT: 1.45mm; MANUFACTURER_NAME: Texas Instruments; MANUFACTURER_PART_NUMBER: TLV9101IDBVR; MOUSER_PART_NUMBER: 595-TLV9101IDBVR; MOUSER_PRICE-STOCK: https://www.mouser.co.uk/ProductDetail/Texas-Instruments/TLV9101IDBVR?qs=P1JMDcb91o6ZLUyc%2FHtrGA%3D%3D
IC2 = ZTP-148SRC1:ZTP-148SRC1: Infrared Detectors THERMOPILE IR,TO-46 PKG FOV 85 Source: Datasheet; DESCRIPTION: Infrared Detectors THERMOPILE IR,TO-46 PKG FOV 85; HEIGHT: 3mm; MANUFACTURER_NAME: Amphenol; MANUFACTURER_PART_NUMBER: ZTP-148SRC1; MOUSER_PART_NUMBER: 527-ZTP-148SRC1; MOUSER_PRICE-STOCK: https://www.mouser.co.uk/ProductDetail/Amphenol-Advanced-Sensors/ZTP-148SRC1?qs=sPbYRqrBIVmlB0PWHks6qA%3D%3D
Q1 = FMMT593TC:FMMT593TC: Bipolar (BJT) Transistor PNP 100 V 1 A 50MHz 500 mW Surface Mount SOT-23-3 Source: Datasheet <https://www.diodes.com/assets/Datasheets/FMMT593.pdf>; DESCRIPTION: Bipolar (BJT) Transistor PNP 100 V 1 A 50MHz 500 mW Surface Mount SOT-23-3; HEIGHT: 1.12mm; MANUFACTURER_NAME: Diodes Incorporated; MANUFACTURER_PART_NUMBER: FMMT593TC; MOUSER_PART_NUMBER: 522-FMMT593TC; MOUSER_PRICE-STOCK: https://www.mouser.co.uk/ProductDetail/Diodes-Incorporated/FMMT593TC?qs=Fd5IDHV0Wqzkyi9CrXqpkA%3D%3D
R1 = rcl:R-US_: RESISTOR, American symbol; SPICEPREFIX: R

## Module AMP_AND_FILTER
Ports: V_TP(io) V_SIG(io) VS_2.5V_OUT(io) VS_5V_OUT(io) 0(io)
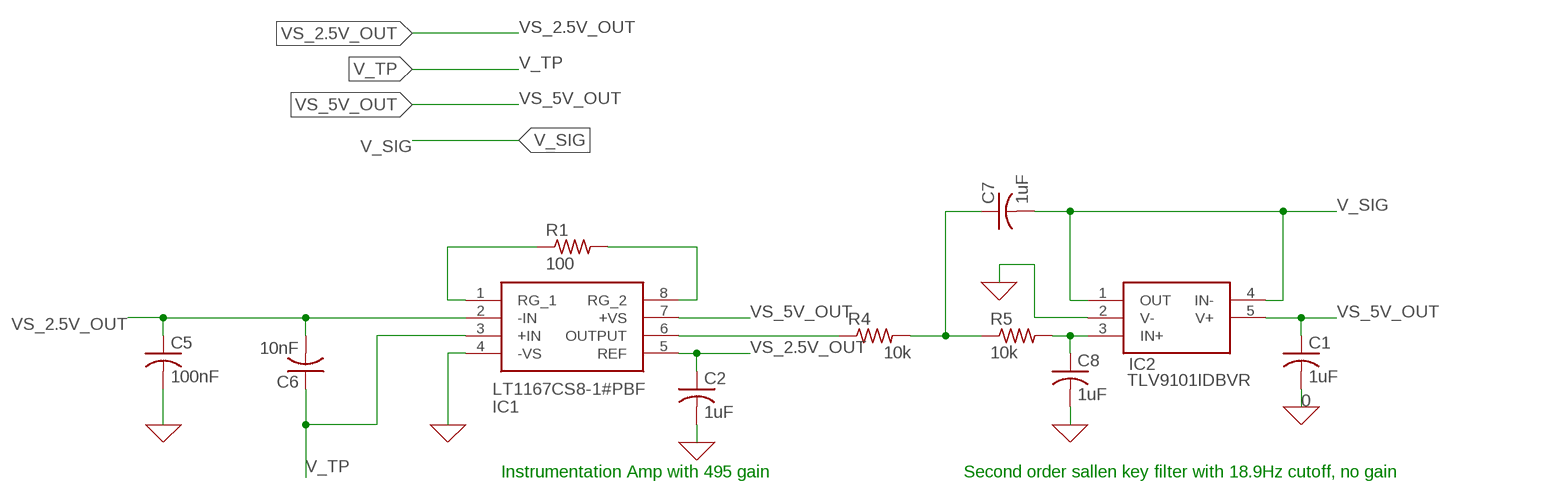
[diagram p6: schematic, module AMP_AND_FILTER, sheet 1]

### Parts
C1  1uF  C-USC0603  [C0603]
C2  1uF  C-USC0603  [C0603]
C5  100nF  C-USC0603  [C0603]
C6  10nF  C-USC0603  [C0603]
C7  1uF  C-USC0603  [C0603]
C8  1uF  C-USC0603  [C0603]
IC1  LT1167CS8-1#PBF  [SOIC127P599X175-8N]
IC2  TLV9101IDBVR  [SOT95P280X145-5N]
R1  100  R-US_R0603  [R0603]
R4  10k  R-US_R0603  [R0603]
R5  10k  R-US_R0603  [R0603]

### Nets
0: C1.2 C2.2 C5.2 C8.2 IC1.4(-VS) IC2.2(V-) ; supply symbol labelled GND
N$3: IC1.6(OUTPUT) R4.1
N$4: IC1.1(RG_1) R1.1
N$5: IC1.8(RG_2) R1.2
N$6: C7.1 R4.2 R5.1
N$7: C8.1 IC2.3(IN+) R5.2
V_SIG: C7.2 IC2.1(OUT) IC2.4(IN-)
V_TP: C6.1 IC1.3(+IN)
VS_2.5V_OUT: C2.1 C5.1 C6.2 IC1.2(-IN) IC1.5(REF)
VS_5V_OUT: C1.1 IC1.7(+VS) IC2.5(V+)

### Notes on the sheet
- Instrumentation Amp with 495 gain | Second order sallen key filter with 18.9Hz cutoff, no gain

### Library data of the parts
C1 C2 C5-C8 = rcl:C-US: CAPACITOR, American symbol; SPICEPREFIX: C
IC1 = LT1167CS8-1#PBF:LT1167CS8-1#PBF: Instrumentation Amplifiers Programmable Prec Inst Amp Source: Datasheet <https://www.google.com/url?sa=t&rct=j&q=&esrc=s&source=web&cd=&ved=2ahUKEwiX6oGy_cT2AhUFLBoKHaJ4BkkQFnoECDYQAQ&url=https://www.analog.com/media/en/technical-documentation/data-sheets/1167fc.pdf&usg=AOvVaw1x3jvf2OheYgevULB3qLIN>; DESCRIPTION: Instrumentation Amplifiers Programmable Prec Inst Amp; HEIGHT: 1.752mm; MANUFACTURER_NAME: Analog Devices; MANUFACTURER_PART_NUMBER: LT1167CS8-1#PBF; MOUSER_PART_NUMBER: 584-LT1167CS8-1#PBF; MOUSER_PRICE-STOCK: https://www.mouser.co.uk/ProductDetail/Analog-Devices/LT1167CS8-1PBF?qs=ytflclh7QUUSP%2FOhUQ1QDg%3D%3D
IC2 = TLV9101IDBVR:TLV9101IDBVR: Single 1MHz, 16-V rail-to-rail input/output, low-offset voltage, low-power op amp Source: Datasheet <http://www.ti.com/lit/ds/symlink/tlv9101.pdf>; DESCRIPTION: Single 1MHz, 16-V rail-to-rail input/output, low-offset voltage, low-power op amp; HEIGHT: 1.45mm; MANUFACTURER_NAME: Texas Instruments; MANUFACTURER_PART_NUMBER: TLV9101IDBVR; MOUSER_PART_NUMBER: 595-TLV9101IDBVR; MOUSER_PRICE-STOCK: https://www.mouser.co.uk/ProductDetail/Texas-Instruments/TLV9101IDBVR?qs=P1JMDcb91o6ZLUyc%2FHtrGA%3D%3D
R1 R4 R5 = rcl:R-US_: RESISTOR, American symbol; SPICEPREFIX: R

## Module DUAL_SLOPE_ADC
Ports: V_BG(io) V_SIG(io) RST_ADC(io) V_TOGGLE(io) ADC_EXT_INT(io) VS_5V_OUT(io) VS_1.5V_OUT(io) 0(io)
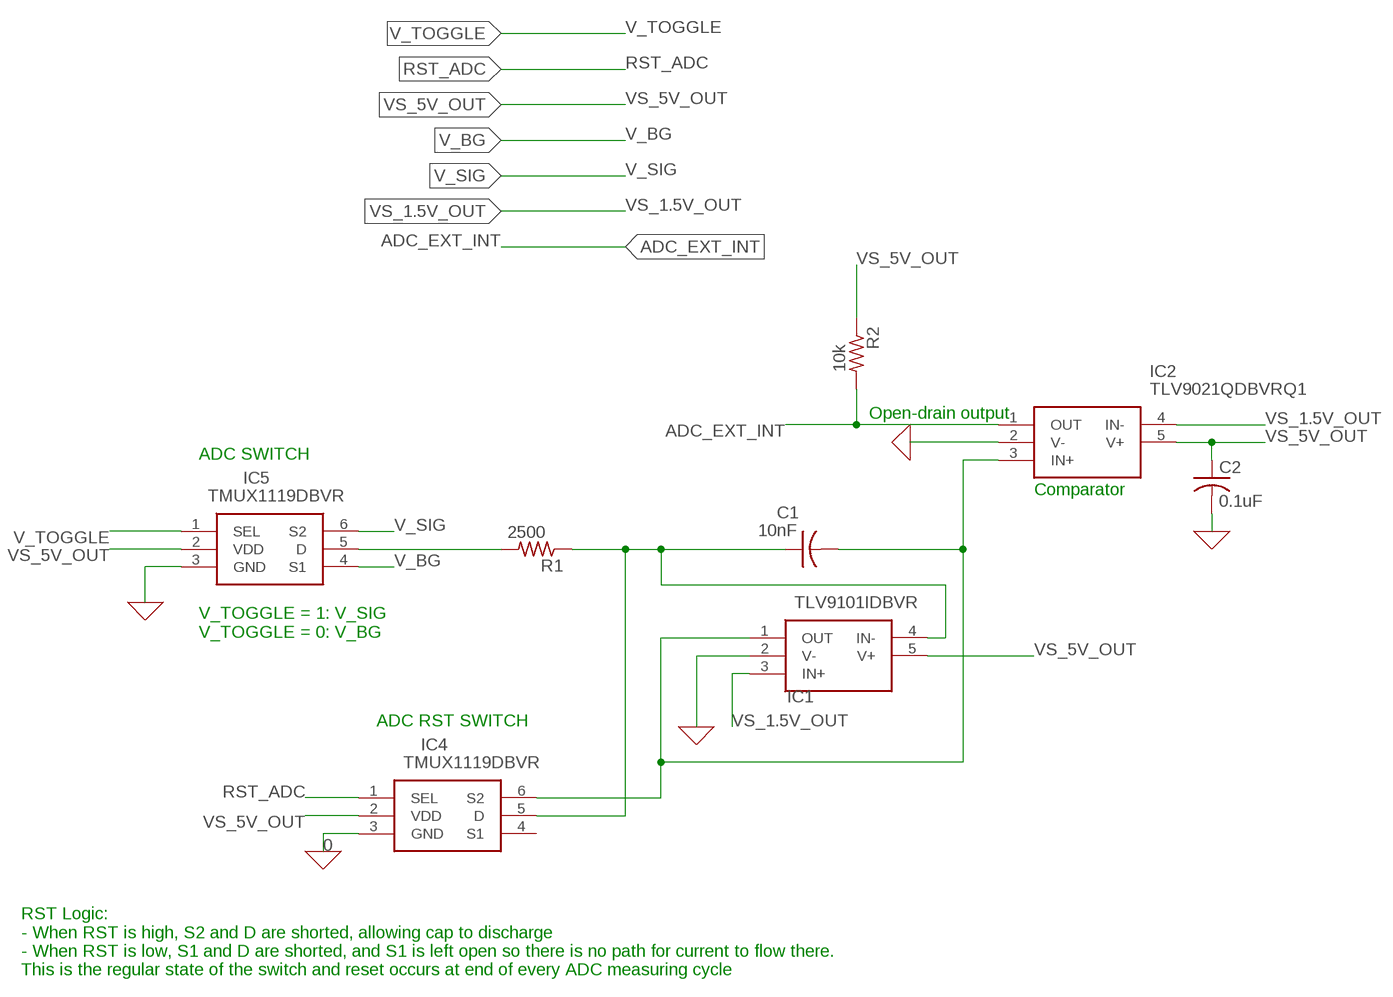
[diagram p7: schematic, module DUAL_SLOPE_ADC, sheet 1]

### Parts
C1  10nF  C-USC0603  [C0603]
C2  0.1uF  C-USC0603  [C0603]
IC1  TLV9101IDBVR  [SOT95P280X145-5N]
IC2  TLV9021QDBVRQ1  [SOT95P280X145-5N]
IC4  TMUX1119DBVR  [SOT95P280X145-6N]
IC5  TMUX1119DBVR  [SOT95P280X145-6N]
R1  2500  R-US_R0603  [R0603]
R2  10k  R-US_R0603  [R0603]

### Nets
0: C2.2 IC1.2(V-) IC2.2(V-) IC4.3(GND) IC5.3(GND) ; supply symbol labelled GND
ADC_EXT_INT: IC2.1(OUT) R2.2
N$1: IC5.5(D) R1.2
N$2: C1.2 IC1.1(OUT) IC2.3(IN+) IC4.6(S2)
N$4: C1.1 IC1.4(IN-) IC4.5(D) R1.1
RST_ADC: IC4.1(SEL)
V_BG: IC5.4(S1)
V_SIG: IC5.6(S2)
V_TOGGLE: IC5.1(SEL)
VS_1.5V_OUT: IC1.3(IN+) IC2.4(IN-)
VS_5V_OUT: C2.1 IC1.5(V+) IC2.5(V+) IC4.2(VDD) IC5.2(VDD) R2.1
Unconnected: IC4.4(S1)

### Notes on the sheet
- Open-drain output
- ADC SWITCH
- Comparator
- V_TOGGLE = 1: V_SIG
  V_TOGGLE = 0: V_BG
- ADC RST SWITCH
- RST Logic:
  - When RST is high, S2 and D are shorted, allowing cap to discharge
  - When RST is low, S1 and D are shorted, and S1 is left open so there is no path for current to flow there. 
  This is the regular state of the switch and reset occurs at end of every ADC measuring cycle

### Library data of the parts
C1 C2 = rcl:C-US: CAPACITOR, American symbol; SPICEPREFIX: C
IC1 = TLV9101IDBVR:TLV9101IDBVR: Single 1MHz, 16-V rail-to-rail input/output, low-offset voltage, low-power op amp Source: Datasheet <http://www.ti.com/lit/ds/symlink/tlv9101.pdf>; DESCRIPTION: Single 1MHz, 16-V rail-to-rail input/output, low-offset voltage, low-power op amp; HEIGHT: 1.45mm; MANUFACTURER_NAME: Texas Instruments; MANUFACTURER_PART_NUMBER: TLV9101IDBVR; MOUSER_PART_NUMBER: 595-TLV9101IDBVR; MOUSER_PRICE-STOCK: https://www.mouser.co.uk/ProductDetail/Texas-Instruments/TLV9101IDBVR?qs=P1JMDcb91o6ZLUyc%2FHtrGA%3D%3D
IC2 = TLV9021QDBVRQ1:TLV9021QDBVRQ1: Analog Comparators HIGH PERFORMANCE 5V OD SINGLE COMPARATOR Source: Datasheet <https://www.ti.com/lit/ds/symlink/tlv9021-q1.pdf?ts=1706850180620&ref_url=https%3A%2F%2Fwww.ti.com%2Fproduct%2FTLV9021-Q1%2Fpart-details%2FTLV9021QDBVRQ1>; DESCRIPTION: Analog Comparators HIGH PERFORMANCE 5V OD SINGLE COMPARATOR; HEIGHT: 1.45mm; MANUFACTURER_NAME: Texas Instruments; MANUFACTURER_PART_NUMBER: TLV9021QDBVRQ1; MOUSER_PART_NUMBER: 595-TLV9021QDBVRQ1; MOUSER_PRICE-STOCK: https://www.mouser.co.uk/ProductDetail/Texas-Instruments/TLV9021QDBVRQ1?qs=Z%252BL2brAPG1KR79adoYSPzQ%3D%3D
IC4 IC5 = TMUX1119DBVR:TMUX1119DBVR: Analog Switch ICs 3-pA, 5-V, 2:1 (SPDT), 1-channel precision multiplexer Source: Datasheet <https://www.ti.com/lit/gpn/TMUX1119>; DESCRIPTION: Analog Switch ICs 3-pA, 5-V, 2:1 (SPDT), 1-channel precision multiplexer; HEIGHT: 1.45mm; MANUFACTURER_NAME: Texas Instruments; MANUFACTURER_PART_NUMBER: TMUX1119DBVR; MOUSER_PART_NUMBER: 595-TMUX1119DBVR; MOUSER_PRICE-STOCK: https://www.mouser.co.uk/ProductDetail/Texas-Instruments/TMUX1119DBVR?qs=9r4v7xj2Lnn%2FqYCDWCSZ7w%3D%3D
R1 R2 = rcl:R-US_: RESISTOR, American symbol; SPICEPREFIX: R

## Board
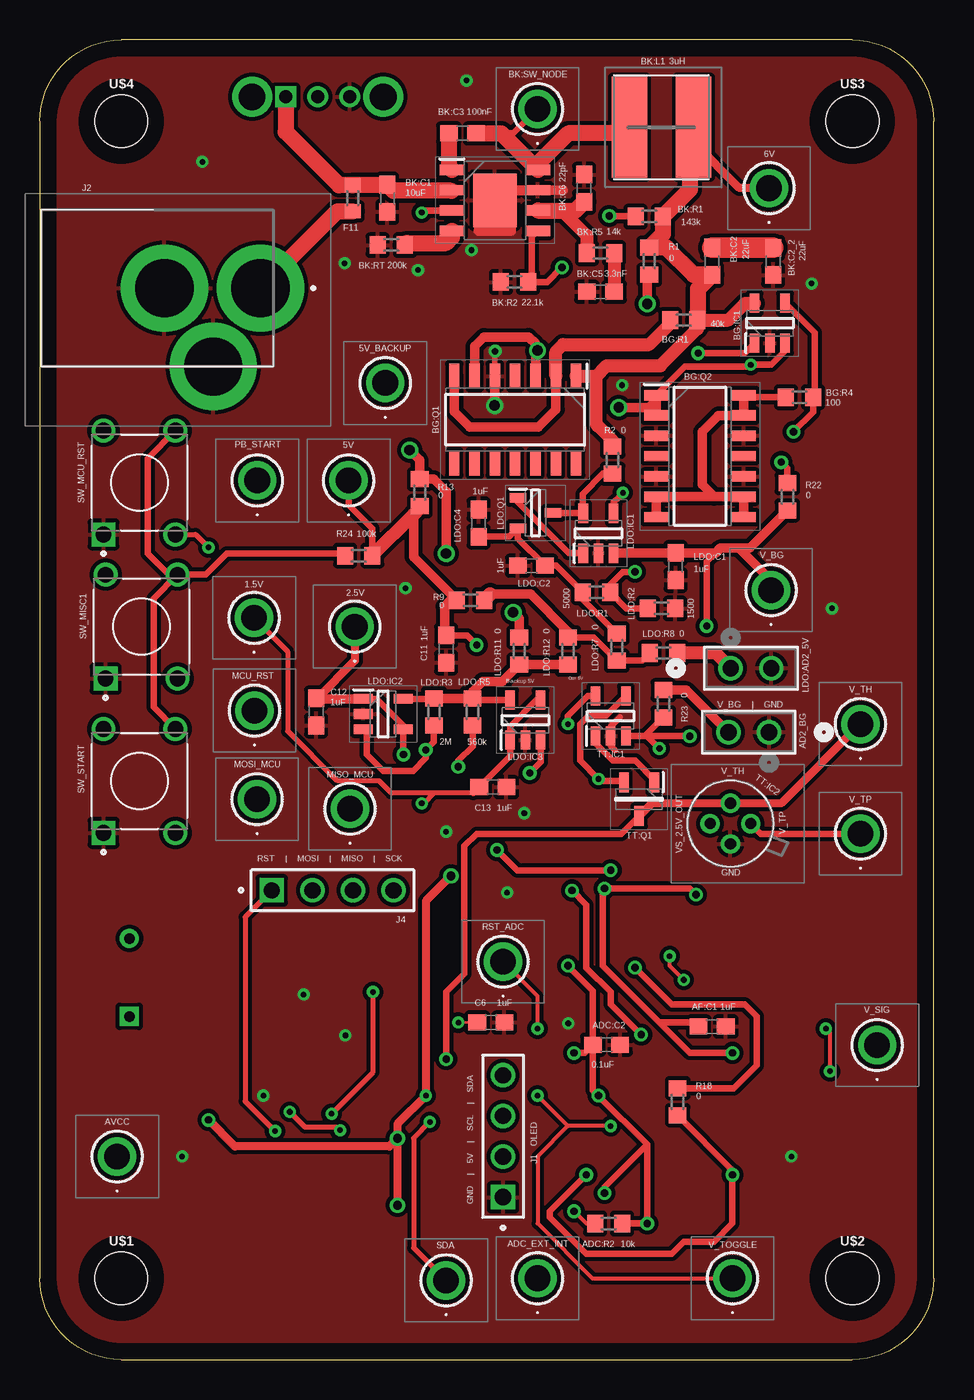
[diagram p8: board, top side]
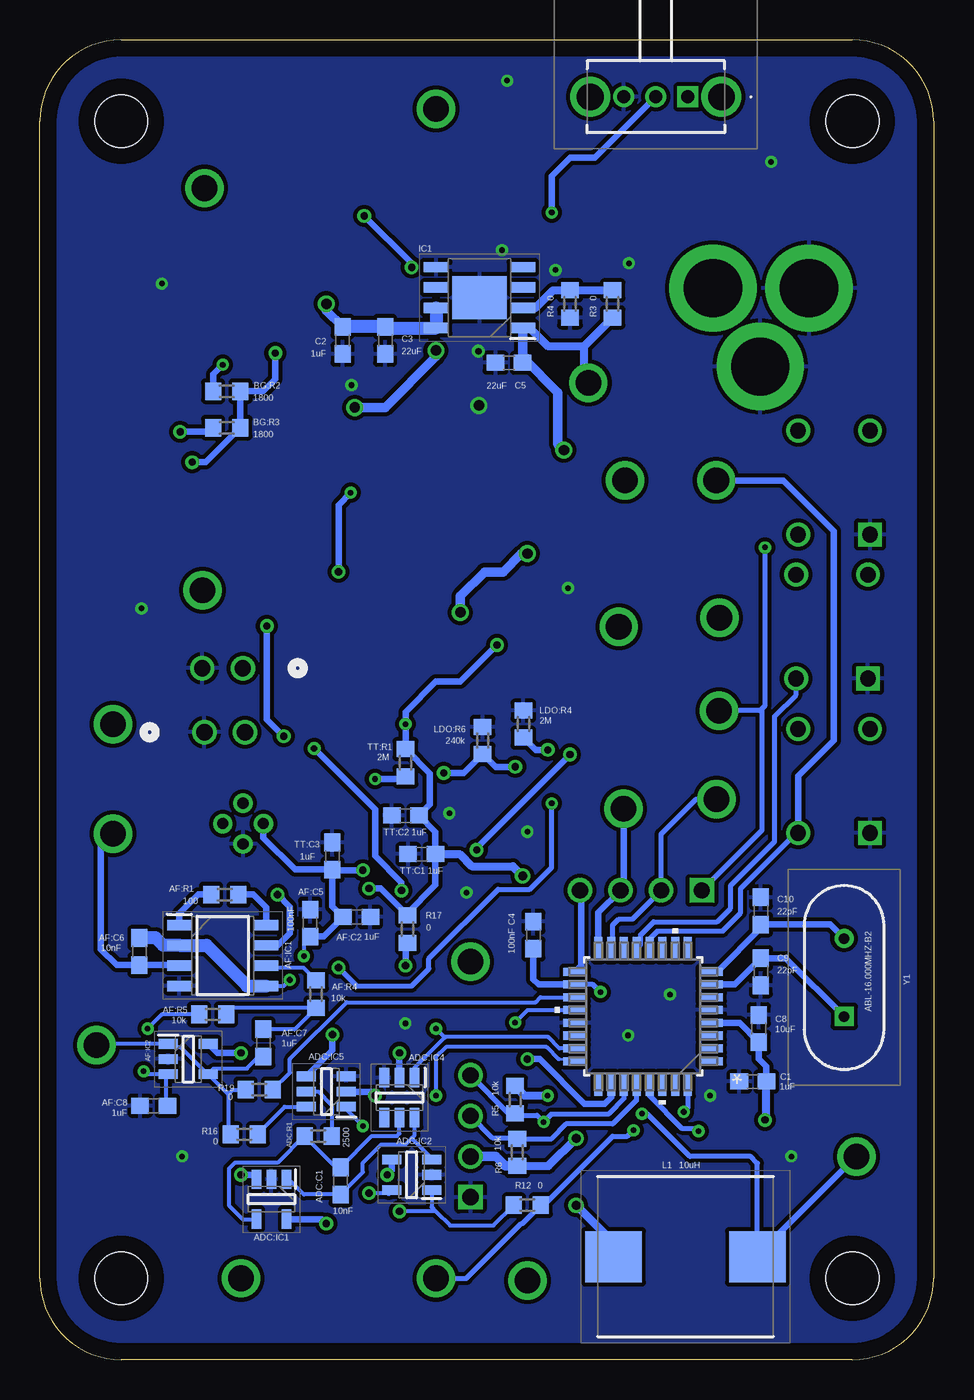
[diagram p9: board, bottom side, seen from below]

Size 55.88 x 82.55 mm. Coordinates in mm from the lower left corner, seen from the top.
Outline: 5.08,0 arc-90 0,5.08 0,77.47 arc-90 5.08,82.55 50.8,82.55 arc-90 55.88,77.47 55.88,5.08 arc-90 50.8,0 5.08,0
Copper layers (1*16): Top 0.035mm / dielectric 1.5mm / Bottom 0.035mm
Design rules "default *": minimum track width 6mil, minimum drill 0.35mm, track to track 6mil, track to pad 6mil, pad to pad 6mil, via to via 6mil, smd to smd 6mil, copper to edge 40mil, drill to drill 6mil, minimum pad ring 10mil, minimum via ring 8mil, stop-mask expansion 4mil, vias tented up to drill 0mil, thermal gap 10mil

### Footprints (pad centres in the part's own frame; a part is rotated, then mirrored left to right if it is on the bottom)
5010 = drill 1.6 pad 2.4: 1 0,0
CONN_RS1-02-G_ADM = drill 1.016 pad 1.524: 1 0,0; 2 2.54,0
C0603 = smd 1.1 x 1: 1 -0.85,0; 2 0.85,0
SOT95P280X145-5N = smd 1.2 x 0.6: 1 -1.25,0.95; 2 -1.25,0; 3 -1.25,-0.95; 4 1.25,-0.95; 5 1.25,0.95
SOT95P280X145-6N = smd 1.2 x 0.6: 1 -1.25,0.95; 2 -1.25,0; 3 -1.25,-0.95; 4 1.25,-0.95; 5 1.25,0; 6 1.25,0.95
R0603 = smd 1 x 1.1: 1 -0.85,0; 2 0.85,0
SOIC127P599X175-8N = smd 1.526 x 0.65: 1 -2.712,1.905; 2 -2.712,0.635; 3 -2.712,-0.635; 4 -2.712,-1.905; 5 2.712,-1.905; 6 2.712,-0.635; 7 2.712,0.635; 8 2.712,1.905
SOIC127P602X175-14N = smd 1.545 x 0.65: 1 -2.728,3.81; 2 -2.728,2.54; 3 -2.728,1.27; 4 -2.728,0; 5 -2.728,-1.27; 6 -2.728,-2.54; 7 -2.728,-3.81; 8 2.728,-3.81; 9 2.728,-2.54; 10 2.728,-1.27; 11 2.728,0; 12 2.728,1.27; 13 2.728,2.54; 14 2.728,3.81
SOIC127P600X163-9N = smd 1.525 x 0.65: 1 -2.688,1.905; 2 -2.688,0.635; 3 -2.688,-0.635; 4 -2.688,-1.905; 5 2.688,-1.905; 6 2.688,-0.635; 7 2.688,0.635; 8 2.688,1.905 | smd 2.71 x 3.35: 9 0,0
WE-TPC_5818/582892 = smd 2.2 x 6.3: 1 -2,0; 2 2.01,0
SLW8645475ARAD = drill 0.8 pad 1.3 square: 1 0,0 | drill 0.8 pad 1.3: 2 2,0; 3 4,0 | drill 1.66 pad 2.49: MH1 -2.1,0; MH2 6.1,0
R0603' = smd 0.87 x 0.98: 1 -0.815,0; 2 0.815,0
SOIC127P600X170-9N = smd 1.525 x 0.65: 1 -2.712,1.905; 2 -2.712,0.635; 3 -2.712,-0.635; 4 -2.712,-1.905; 5 2.712,-1.905; 6 2.712,-0.635; 7 2.712,0.635; 8 2.712,1.905 | smd 3.4 x 2.71: 9 0,0
SAMTEC_TSW-104-07-F-S = drill 1.02 pad 1.37 square: 01 -3.81,0 | drill 1.02 pad 1.37: 02 -1.27,0; 03 1.27,0; 04 3.81,0
163179PHEX = drill 3.64 pad 5.46: A 5.15,1.365; B 2.2,-3.535; C -0.85,1.365
INDPM110100X400N = smd 3.55 x 3.2: 1 -4.5,0; 2 4.5,0
SOT95P230X110-3N = smd 1.05 x 0.6: 1 -1.1,0.95; 2 -1.1,-0.95; 3 1.1,0
SW_1825910-6-4 = drill 0.99 square: 1 -3.25,2.25 | drill 0.99: 2 3.25,2.25; 3 -3.25,-2.25; 4 3.25,-2.25
ZTP148SRC1 = drill 0.7 pad 1.2: 1 0,1.27; 2 0,-1.27; 3 1.27,0; 4 -1.27,0
SOT95P237X112-3N = smd 1.25 x 0.6: 1 -1.05,0.95; 2 -1.05,-0.95; 3 1.05,0
32A_MCH = smd 1.461 x 0.501: 1 -4.25,2.8; 2 -4.25,2; 3 -4.25,1.2; 4 -4.25,0.4; 5 -4.25,-0.4; 6 -4.25,-1.2; 7 -4.25,-2; 8 -4.25,-2.8; 17 4.25,-2.8; 18 4.25,-2; 19 4.25,-1.2; 20 4.25,-0.4; 21 4.25,0.4; 22 4.25,1.2; 23 4.25,2; 24 4.25,2.8 | smd 0.501 x 1.461: 9 -2.8,-4.25; 10 -2,-4.25; 11 -1.2,-4.25; 12 -0.4,-4.25; 13 0.4,-4.25; 14 1.2,-4.25; 15 2,-4.25; 16 2.8,-4.25; 25 2.8,4.25; 26 2,4.25; 27 1.2,4.25; 28 0.4,4.25; 29 -0.4,4.25; 30 -1.2,4.25; 31 -2,4.25; 32 -2.8,4.25
STAND-OFF = hole 3.302: 0,0
ABL = drill 0.657 pad 1.205 square: 1 0,0 | drill 0.657 pad 1.205: 2 4.88,0

### Placement (x,y rotation side)
1.5V  13.39,46.4 0 top
2.5V  19.68,45.85 0 top
5V  19.3,54.99 0 top
5V_BACKUP  21.59,61.09 0 top
6V  45.59,73.28 0 top
AD2_BG  45.59,39.24 180 top
ADC:C1  10nF  [C0603]  37.08,11.18 270 bottom
ADC:C2  0.1uF  [C0603]  35.43,19.68 0 top
ADC:IC1  TLV9101IDBVR  [SOT95P280X145-5N]  41.4,10.03 270 bottom
ADC:IC2  TLV9021QDBVRQ1  [SOT95P280X145-5N]  32.64,11.56 180 bottom
ADC:IC4  TMUX1119DBVR  [SOT95P280X145-6N]  33.4,16.38 270 bottom
ADC:IC5  TMUX1119DBVR  [SOT95P280X145-6N]  37.97,16.76 180 bottom
ADC:R1  2500  [R0603]  38.48,13.97 0 bottom
ADC:R2  10k  [R0603]  35.56,8.51 180 top
ADC_EXT_INT  31.11,5.08 0 top
AF:C1  1uF  [C0603]  42.04,20.83 0 top
AF:C2  1uF  [C0603]  36.07,27.69 0 bottom
AF:C5  100nF  [C0603]  38.99,27.3 90 bottom
AF:C6  10nF  [C0603]  49.66,25.53 90 bottom
AF:C7  1uF  [C0603]  41.91,19.81 270 bottom
AF:C8  1uF  [C0603]  48.77,15.88 180 bottom
AF:IC1  LT1167CS8-1#PBF  [SOIC127P599X175-8N]  44.45,25.27 0 bottom
AF:IC2  TLV9101IDBVR  [SOT95P280X145-5N]  46.61,18.8 0 bottom
AF:R1  100  [R0603]  44.32,29.08 0 bottom
AF:R4  10k  [R0603]  38.61,22.86 270 bottom
AF:R5  10k  [R0603]  45.09,21.59 180 bottom
AVCC  4.83,12.7 0 top
BG:IC1  TLV9101IDBVR  [SOT95P280X145-5N]  45.64,64.83 90 top
BG:Q1  300S14-U  [SOIC127P602X175-14N]  29.72,58.8 270 top
BG:Q2  300S14-U  [SOIC127P602X175-14N]  41.27,56.52 0 top
BG:R1  40k  [R0603]  40.26,65.02 0 top
BG:R2  1800  [R0603]  44.2,60.58 0 bottom
BG:R3  1800  [R0603]  44.2,58.29 0 bottom
BG:R4  100  [R0603]  47.5,60.2 0 top
BK:C1  10uF  [C0603]  21.72,72.64 270 top
BK:C2  22uF  [C0603]  42.04,68.71 90 top
BK:C2_2  22uF  [C0603]  45.85,68.69 270 top
BK:C3  100nF  [C0603]  26.42,76.71 0 top
BK:C5  3.3nF  [C0603]  35.05,66.8 180 top
BK:C6  22pF  [C0603]  34.04,73.28 90 top
BK:IC1  AP64350SP-13  [SOIC127P600X163-9N]  28.45,72.52 0 top
BK:L1  3uH  [WE-TPC_5818/582892]  38.86,77.09 0 top
BK:R1  143k  [R0603]  38.1,71.5 0 top
BK:R2  22.1k  [R0603]  29.67,67.41 0 top
BK:R5  14k  [R0603]  35.05,69.22 180 top
BK:RT  200k  [R0603]  21.97,69.72 0 top
BK:S1  SLW-864547-5A-RA-D  [SLW8645475ARAD]  15.37,78.99 180 bottom
BK:SW_NODE  5010  [5010]  31.11,78.23 0 top
C1  11.3,17.4 180 bottom
C2  36.96,63.75 270 bottom
C3  34.29,63.75 270 bottom
C4  25.02,26.54 90 bottom
C5  26.54,62.36 180 bottom
C6  28.19,21.08 0 top
C8  10.92,20.7 90 bottom
C9  10.8,24.26 90 bottom
C10  10.8,28.07 270 bottom
C11  25.4,44.45 270 top
C12  17.27,40.51 270 top
C13  28.32,35.81 0 top
F11  FUSE0603  [R0603']  19.56,72.64 90 top
IC1  28.39,66.43 180 bottom
J1  28.96,13.97 90 top
J2  8.64,65.66 0 top
J4  18.3,29.35 0 top
L1  15.51,6.43 180 bottom
LDO:AD2_5V  RS1-02-G  [CONN_RS1-02-G_ADM]  43.19,43.25 0 top
LDO:C1  1uF  [C0603]  39.75,49.61 270 top
LDO:C2  1uF  [C0603]  30.73,49.66 180 top
LDO:C4  1uF  [C0603]  27.43,52.32 90 top
LDO:IC1  TLV9101IDBVR  [SOT95P280X145-5N]  34.92,51.69 90 top
LDO:IC2  TLV9101IDBVR  [SOT95P280X145-5N]  21.46,40.39 0 top
LDO:IC3  TLV9101IDBVR  [SOT95P280X145-5N]  30.35,40 90 top
LDO:Q1  PBSS8110T,215  [SOT95P230X110-3N]  30.99,52.96 0 top
LDO:R1  5000  [R0603]  34.8,48.01 180 top
LDO:R2  1500  [R0603]  38.86,46.99 180 top
LDO:R3  2M  [R0603]  24.64,40.51 90 top
LDO:R4  2M  [R0603]  25.65,39.75 270 bottom
LDO:R5  560k  [R0603]  27.05,40.51 270 top
LDO:R6  240k  [R0603]  28.19,38.73 270 bottom
LDO:R7  0  [R0603]  36.07,44.58 270 top
LDO:R8  0  [R0603]  38.99,44.2 180 top
LDO:R11  0  [R0603]  29.97,44.32 270 top
LDO:R12  0  [R0603]  33.02,44.32 270 top
MCU_RST  13.41,40.59 0 top
MISO_MCU  19.39,34.46 0 top
MOSI_MCU  13.58,35.05 0 top
PB_START  13.59,54.99 0 top
R1  38.1,68.71 270 top
R2  35.81,56.26 270 top
R3  20.07,66.04 270 bottom
R4  22.73,66.04 90 bottom
R5  26.16,16.26 90 bottom
R6  26.04,12.95 270 bottom
R9  26.92,47.5 180 top
R12  25.4,9.65 0 bottom
R13  23.75,54.23 90 top
R16  43.11,14.08 0 bottom
R17  32.89,26.92 270 bottom
R18  39.88,16.13 90 top
R19  42.16,16.89 0 bottom
R22  46.74,53.97 270 top
R23  38.99,41.02 270 top
R24  19.94,50.29 0 top
RST_ADC  28.96,24.89 0 top
SDA  25.4,4.95 0 top
SW_MCU_RST  6.22,54.86 90 top
SW_MISC1  6.35,45.85 90 top
SW_START  6.22,36.2 90 top
TT:C1  1uF  [C0603]  32,31.62 180 bottom
TT:C2  1uF  [C0603]  33.02,34.04 180 bottom
TT:C3  1uF  [C0603]  37.59,31.5 90 bottom
TT:IC1  TLV9101IDBVR  [SOT95P280X145-5N]  35.69,40.26 90 top
TT:IC2  ZTP-148SRC1  [ZTP148SRC1]  43.18,33.53 180 top
TT:Q1  FMMT593TC  [SOT95P237X112-3N]  37.46,35.05 270 top
TT:R1  2M  [R0603]  33.02,37.34 90 bottom
U1  18.16,21.46 180 bottom
U$1  [STAND-OFF]  5.08,5.08 0 top
U$2  [STAND-OFF]  50.8,5.08 0 top
U$3  [STAND-OFF]  50.8,77.47 0 top
U$4  [STAND-OFF]  5.08,77.47 0 top
V_BG  45.72,48.13 0 top
V_SIG  52.36,19.67 0 top
V_TH  51.31,39.75 0 top
V_TOGGLE  43.31,5.08 0 top
V_TP  51.31,32.89 0 top
Y1  5.59,21.46 90 bottom

### Tracks (layer width: path | path; a pad name or v marks a point on that pad's centre or on a via)
0  (via drill 0.35, 0.4, 0.65)
  Top 0.152: 35.69,38.39 TT:IC1.2 35.69,39.6 | 28.45,59.7 v28.43,59.69 | 28.45,63.06 v28.46,63.07 | BK:IC1.9 28.45,72.14 | 29.44,73.13 28.45,72.14 | 28.45,72.14 27.43,71.12 | 30.97,73.13 30.99,73.15 BK:IC1.7 31.15,73.16
  Top 0.356: BG:Q1.5 28.45,63.06
  Top 0.381: 35.69,38.39 35.97,38.11 | 35.69,39.6 36.27,40.18
  Top 0.61: BG:Q1.5 28.45,59.7 | 31.15,73.16 32.72,73.16
  Top 0.635: 27.43,71.12 27.43,70.61 29.46,70.61 29.46,71.12 | 30.97,73.13 29.44,73.13
  other vias: 48.26,67.31 36.4,60.96 22.86,48.26 49.53,46.99 46.99,12.7 33.03,21.03 8.89,12.7 25.4,33.02 29.21,29.21 19.05,68.58 10.16,74.93 26.67,80.01 16.48,22.83 19.1,20.28 13.97,16.51 30.28,34.18 26.99,69.4 23.64,68.16
  pour Top (isolate 0.254): 0,82.55 0,0 55.88,0 55.88,82.55
  pour Bottom (isolate 0.254): 0,82.55 0,0 55.88,0 55.88,82.55
ADC:N$1
  Bottom 0.254: ADC:R1.2 37.63,15.91 38.48,16.76 ADC:IC5.5
ADC:N$2
  Bottom 0.152: 31.39,12.59 ADC:IC2.3
  Bottom 0.254: ADC:IC1.1 40.33,11.28 39.37,10.33 ADC:C1.2 35.69,11.72 35.69,12.32 34.54,13.46 33.02,13.46 32.64,13.84 | 32.64,13.84 32.45,14.03 ADC:IC4.6 | 32.64,13.84 31.39,12.59
ADC:N$4
  Bottom 0.152: ADC:R1.1 39.37,13.97
  Bottom 0.254: ADC:IC1.4 43.2,8.78 44.07,9.65 44.07,11.94 43.69,12.32 41.02,12.32 39.37,13.97 | ADC:R1.1 37.39,12.03 ADC:C1.1 35.12,13.99 33.55,13.99 33.4,14.14 ADC:IC4.5
ADC_EXT_INT  (via drill 0.35)
  Top 0.305: v15.62,15.49 16.58,14.54 18.57,14.54 v18.77,14.34
  Bottom 0.152: U1.32
  Bottom 0.305: ADC_EXT_INT.1 29.21,5.08 25.78,8.51 25.69,8.51 R12.2 24.38,9.65 20.07,13.97 19.14,13.97 v18.77,14.34 | U1.32 15.37,15.75 v15.62,15.49
AF:N$3
  Bottom 0.254: AF:IC1.6 41.62,24.52 39.41,24.52 AF:R4.1
AF:N$4
  Bottom 0.406: AF:IC1.1 47.16,27.89 45.97,29.08 AF:R1.1
AF:N$5
  Bottom 0.406: AF:R1.2 42.55,29.08 41.74,28.28 AF:IC1.8
AF:N$6
  Bottom 0.254: AF:R5.1 43.81,22.01 AF:R4.2 39.96,20.66 AF:C7.1
AF:N$7  (via drill 0.35)
  Top 0.254: v49.4,18.03 49.4,20.45 v49.15,20.7
  Bottom 0.254: AF:R5.2 48.26,21.59 v49.15,20.7 | AF:IC2.3 48.01,17.85 | 48.01,17.85 49.21,17.85 v49.4,18.03 | 48.01,17.85 48.01,15.96 AF:C8.1
BG:N$1
  Top 0.61: BG:Q1.7 25.91,59.31 26.89,58.33 31.15,58.33 32.26,59.44 BG:Q1.2
  Top 0.813: BG:Q1.2 32.26,63.05 32.7,63.5 38.1,63.5 39.41,64.81 BG:R1.1
BG:N$2  (via drill 0.35, 0.65)
  Top 0.406: BG:Q2.1 40.33,62.11 44.33,62.11 v44.45,62.23 45.72,62.23 46.59,63.1 BG:IC1.3
  Top 0.508: 38.04,59.56 38.55,60.07 BG:Q2.1
  Top 0.61: BG:Q1.3 30.99,62.99 | 30.99,62.99 30.99,63.54 30.55,63.97 27.76,63.97 27.18,63.39 BG:Q1.6 | 30.99,62.99 v31.11,63.12 | v36.2,59.56 38.04,59.56 BG:Q2.2 BG:Q2.1
  Bottom 0.406: v44.45,62.23 45.05,61.63 BG:R2.1
  Bottom 0.61: v31.11,63.12 31.11,62.74 34.29,59.56 v36.2,59.56
BG:N$4  (via drill 0.45)
  Top 0.406: BG:IC1.4 48.45,64.23 48.45,60.3 BG:R4.2 48.35,59.27 v47.12,58.04
  Bottom 0.406: v47.12,58.04 45.3,58.04 BG:R3.1
BG:N$5
  Top 0.406: BG:R4.1 44.13,60.2 BG:Q2.14
  Top 0.61: BG:Q2.7 BG:Q2.6 42.16,53.97 | BG:Q2.14 BG:Q2.13 42.42,59.05 41.4,58.04 41.4,54.74 42.16,53.97 | 42.16,53.97 BG:Q2.9 BG:Q2.8
BK:EN  (via drill 0.35)
  Top 0.406: v23.88,71.75 24,71.88 BK:IC1.3
  Bottom 0.406: BK:S1.2 21.18,75.18 22.73,75.18 23.88,74.04 v23.88,71.75
BK:N$1
  Top 1.016: BK:RT.2 22.95,69.85 25.4,69.85 25.76,70.21 BK:IC1.4
BK:N$2
  Top 0.406: 28.85,76.71 29.59,76.71 BK:SW_NODE.1
  Top 1.016: BK:L1.1 36.48,76.71 33.04,76.71 31.14,74.8 BK:IC1.8 28.85,76.71 BK:C3.2
BK:N$3
  Top 1.016: BK:C3.1 25.57,74.62 BK:IC1.1
BK:N$4
  Top 1.27: BK:C2_2.1 42.05,69.54 BK:C2.2
BK:N$5
  Top 0.813: 32.64,71.88 34.2,70.32 BK:R5.2
  Top 1.016: BK:IC1.6 32.64,71.88 33.49,71.88 BK:C6.1
BK:N$6  (via drill 0.45)
  Top 0.406: BK:IC1.5 30.75,70.23 30.75,67.65 BK:R2.2 31.73,67.41 v32.64,68.33 | BK:R1.1 37.21,71.54 v35.6,71.54
  Bottom 0.406: v32.64,68.33 32.64,68.58 v35.6,71.54
BK:N$7
  Top 0.813: BK:R5.1 BK:C5.1
EXT_CLK_1
  Bottom 0.406: U1.7 12.44,23.46 C9.2 9.23,25.11 Y1.1
EXT_CLK_2
  Bottom 0.406: Y1.2 6.46,27.22 C10.2 10.8,27 13.53,24.26 U1.8
LDO:LS_5V
  Top 0.152: LDO:R3.2 24.64,41.34
  Top 0.406: LDO:R3.2 24.61,41.34 LDO:IC2.5 | LDO:IC3.5 27.16,41.25 LDO:R5.1
  Top 0.61: LDO:R12.2 LDO:R11.2 28.92,42.42 27.69,42.42 27.05,41.78 LDO:R5.1 24.66,41.36 24.64,41.34
LDO:N$1  (via drill 0.35, 0.45)
  Top 0.406: v37.21,49.28 36.45,49.28 35.65,48.47 LDO:R1.1 36.66,46.99 LDO:R2.2 | LDO:IC1.4 35.88,53.63 36.25,54 36.25,54.03 v36.45,54.23
  Bottom 0.406: v37.21,49.28 37.21,53.47 v36.45,54.23
LDO:N$2  (via drill 0.45)
  Top 0.406: LDO:R3.1 24.64,38.65 v24.13,38.14 24.13,37.63 23.33,36.83 21.46,36.83 20.45,37.85 20.45,39.2 LDO:IC2.3
  Bottom 0.152: v24.13,38.14 24.26,38.14
  Bottom 0.406: LDO:R4.2 24.89,38.14 24.26,38.14
LDO:N$3
  Top 0.813: LDO:AD2_5V.1 42.25,44.2 LDO:R8.1
LDO:N$4
  Top 0.33: 33.08,50.44 29.89,53.63
  Top 0.406: LDO:Q1.1 29.89,53.63 | 33.08,50.44 LDO:IC1.1
LDO:N$5
  Top 0.406: LDO:C4.1 29.35,51.47 LDO:Q1.2 29.89,51.35 LDO:C2.1 32.3,49.66 LDO:R1.2 33.95,47.55 LDO:R7.1
LDO:N$6  (via drill 0.45)
  Top 0.152: LDO:IC3.3 31.3,38.41
  Top 0.406: 31.3,38.41 31.3,37.37 v30.63,36.7 | v26.16,37.08 26.16,37.47 27.05,38.35 LDO:R5.2
  Bottom 0.406: v30.63,36.7 29.38,36.7 LDO:R6.2 27.39,37.08 v26.16,37.08
MCU_RST  (via drill 0.35)
  Top 0.305: SW_MCU_RST.3 9.73,51.61 v10.54,50.8 | v14.7,14.29 12.83,16.16 12.83,27.68 J4.01
  Bottom 0.305: v10.54,50.8 10.54,40.89 10.73,40.7 | 10.73,40.7 10.84,40.59 MCU_RST.1 | 10.73,40.7 10.73,33.11 J4.01 | U1.29 17.76,16.48 15.75,14.47 14.88,14.47 v14.7,14.29
MISO_MCU
  Bottom 0.406: U1.16 20.96,27.96 J4.03 19.38,29.54 MISO_MCU.1
MOSI_MCU
  Bottom 0.305: U1.15 20.07,25.81 20.07,27.18 19.68,27.56 18.82,27.56 J4.02 17.03,32.88 14.86,35.05 MOSI_MCU.1
N$1
  Top 0.406: R2.2 35.2,55.41 33.93,54.14 33.93,52.99 LDO:IC1.5 32.11,52.94 LDO:Q1.3
N$2
  Bottom 0.254: R16.2 42.26,14.13 40.57,15.81 ADC:IC5.6
N$3
  Top 1.016: J2.A 18.59,71.83 F11.1
N$4  (via drill 0.35)
  Top 0.305: v20.83,22.99 20.83,17.97 v18.23,15.38
  Bottom 0.152: 11.01,6.51 L1.1
  Bottom 0.305: v18.23,15.38 17.92,15.38 15.24,12.7 11.43,12.7 11.01,12.28 L1.1 | v20.83,22.99 21.3,23.46 U1.18
  Bottom 0.406: C4.1 25.02,23.79 24.69,23.46 U1.18 | AVCC.1 11.01,6.51
N$5  (via drill 0.45)
  Top 0.406: R18.1 43.31,11.85 v43.31,11.56 43.31,8.51 42.16,7.37 40.26,7.37 39.5,6.6 34.16,6.6 31.88,8.89 31.88,9.27 v34.16,11.56
  Bottom 0.406: ADC:IC1.3 42.63,11.56 v43.31,11.56 | ADC:IC2.4 33.89,11.83 v34.16,11.56
N$6  (via drill 0.45)
  Top 0.406: v33.02,24.64 34.58,23.07 ADC:C2.1 | ADC:C2.1 34.08,19.18 v33.4,19.18 | 37.97,13.46 35.31,10.79 v35.31,10.41 | ADC:R2.1 v37.97,8.51 37.97,13.46 | 37.97,13.46 v34.92,16.51 34.58,16.85 ADC:C2.1
  Bottom 0.254: v35.31,10.41 34.08,10.41
  Bottom 0.406: R17.2 33.02,25.95 v33.02,24.64 | 34.08,10.41 ADC:IC2.5 | ADC:IC1.5 38.25,8.78 v37.97,8.51 | ADC:IC4.2 v33.4,19.18 | ADC:IC5.2 36.7,16.74 35.16,16.74 v34.92,16.51
N$7  (via drill 0.45)
  Top 0.406: BG:IC1.1 44.06,62.96 v41.16,62.96 | v46.35,56.13 46.74,55.75 R22.1
  Bottom 0.406: v41.16,62.96 41.16,61.33 41.91,60.58 BG:R2.2 BG:R3.2 45.51,56.13 v46.35,56.13
N$9  (via drill 0.65)
  Top 0.61: v37.97,66.04 37.97,67.73
  Top 0.813: 37.97,67.73 R1.2
  Bottom 0.61: C2.1 37.97,65.62 v37.97,66.04
  Bottom 0.813: IC1.7 IC1.8 34.21,64.53 C3.1 C2.1
N$10
  Bottom 0.508: IC1.2 24.88,65.8 23.79,66.89 R4.2 R3.1
N$11
  Top 0.61: R23.1 40.42,41.87 AD2_BG.2
N$14  (via drill 0.45)
  Top 0.152: ADC:R2.2 34.16,8.51
  Top 0.254: 34.16,8.51 v33.4,9.27
  Bottom 0.254: ADC:IC2.1 31.39,9.54 31.11,9.27 | 31.11,9.27 30.23,8.38 27.52,8.38 R12.1 | 31.11,9.27 v33.4,9.27
N$15  (via drill 0.35)
  Top 0.152: C6.1 v26.16,21.08
  Bottom 0.254: U1.20 25.38,21.86 v26.16,21.08
N$19
  Top 0.406: SW_MCU_RST.4 6.73,56.37 6.73,50.42 8.05,49.1 SW_MISC1.4 | SW_MISC1.4 7.11,47.61 7.11,40.81 SW_START.4 | SW_MISC1.4 10.36,49.1 11.68,50.42 18.96,50.42 R24.1
PB_MISC1
  Bottom 0.305: U1.13 18.32,25.96 18.32,26.57 17.5,27.38 13.54,27.38 12.69,28.23 12.69,29.64 9.94,32.4 9.94,40.25 8.6,41.59 SW_MISC1.3
PB_START
  Bottom 0.305: SW_START.3 8.58,32.95 12.07,29.46 12.07,27.94 13.21,26.8 17.29,26.8 17.76,26.32 U1.12
  Bottom 0.406: SW_START.3 8.47,36.49 6.22,38.74 6.22,51.82 9.4,54.99 PB_START.1
RST_ADC  (via drill 0.35)
  Top 0.254: v31.11,20.7 31.11,22.73 RST_ADC.1
  Bottom 0.254: U1.23 23.4,19.46 24.11,20.17 30.55,20.17 30.57,20.15 | ADC:IC4.1 32.45,18.27 30.57,20.15 | 30.57,20.15 v31.11,20.7
SCK_MCU
  Bottom 0.406: J4.04 22.03,29.27 22.03,24.64 U1.17
SCL
  Bottom 0.152: R6.1 26.07,13.84
  Bottom 0.305: R6.1 23.91,13.8 22.99,14.73 20.07,14.73 18.56,16.24 U1.28 | J1.03 27.56,13.84 26.07,13.84
SDA  (via drill 0.35)
  Top 0.305: SDA.1 23.37,6.98 23.37,13.84 v24.38,14.86
  Bottom 0.152: R5.1 26.58,15.41
  Bottom 0.305: R5.1 26.04,15.28 24.8,15.28 v24.38,14.86 23.88,15.37 20.32,15.37 19.36,16.33 U1.27 | J1.04 26.58,15.41
TT:N$1
  Top 0.406: TT:Q1.1 38.41,36.27 37.22,37.46 35.83,37.46 34.74,38.56 TT:IC1.1
TT:N$3  (via drill 0.35)
  Top 0.406: TT:IC1.4 35.42,40.29 34.32,40.29 33.78,39.75 33.78,37.47 v34.92,36.32 35.05,36.2 36.42,36.2 TT:Q1.2
  Bottom 0.406: TT:R1.1 33.02,36.32 v34.92,36.32
V_BG  (via drill 0.4, 0.45)
  Top 0.152: 37.83,39.01 37.21,39.01
  Top 0.406: 42.25,50.47 41.69,49.91 v41.69,45.89 | v40.64,38.99 40.62,39.01 37.21,39.01 TT:IC1.3 37.95,39.01 v38.73,38.23 | R23.2 37.83,39.01 | v33.27,29.34 34.16,28.45 34.16,24.51 35.69,22.99 35.69,22.23 v37.59,20.32
  Top 0.61: R22.2 44.37,50.76 43.69,50.76 | 43.69,50.76 42.55,50.76 42.25,50.47 LDO:C1.1 35.9,50.47 LDO:IC1.3 | V_BG.1 45.72,48.73 43.69,50.76
  Bottom 0.406: v41.69,45.89 41.69,40.04 v40.64,38.99 | ADC:IC5.4 37.59,19.34 v37.59,20.32 | v33.27,29.34 33.27,29.84 34.92,31.5 34.92,34.42 v38.73,38.23
V_SIG
  Bottom 0.254: AF:IC2.4 45.38,17.85 47.1,19.56 47.67,19.56 AF:IC2.1 52.28,19.75 V_SIG.1 | AF:IC2.4 44.11,16.6 | R19.1 43.05,16.85 43.86,16.85 44.11,16.6 | AF:C7.2 42.19,18.96 42.94,18.21 45,18.21 AF:IC2.4 | 44.11,16.6 44.11,14.24 R16.1
V_SIG_ADC
  Bottom 0.254: R19.2 40.26,17.95 40.26,18.8 36.7,22.35 24.89,22.35 24.58,22.66 U1.19
V_TH  (via drill 0.45)
  Top 0.406: TT:Q1.3 36.36,32.89 27.3,32.89 26.54,32.13 26.54,24.13 25.4,22.99 v25.4,18.8
  Top 0.508: V_TH.1 46.35,34.8 TT:IC2.2 38.26,34.8 TT:Q1.3
  Bottom 0.406: U1.26 20.16,16.41 20.57,16 21.84,16 24.64,18.8 v25.4,18.8
V_TOGGLE  (via drill 0.35)
  Top 0.254: v35.69,14.6 33.02,14.6 | 33.02,14.6 v31.11,16.51 | 33.02,14.6 31.11,12.7 31.11,8.51 34.54,5.08 V_TOGGLE.1
  Bottom 0.152: ADC:IC5.1 36.72,15.64 | 23.43,18.79 22.54,18.79 U1.24
  Bottom 0.254: 36.72,15.64 v35.69,14.6 | 23.43,18.79 24.19,19.55 30.49,19.55 31.11,18.92 v31.11,16.51
V_TP
  Top 0.406: V_TP.1 45.09,32.89 TT:IC2.4
  Bottom 0.406: V_TP.1 52.07,32.13 52.07,25.65 51.09,24.68 AF:C6.1 47.2,24.68 AF:IC1.3
VS_1.5V_OUT  (via drill 0.35, 0.45)
  Top 0.305: 27.09,35.43 24.64,35.43 | 24.64,35.43 21.97,35.43 21.21,36.2 18.61,36.2 15.49,39.31 15.49,44.29 1.5V.1 | 24.64,35.43 24,34.8 v23.88,34.8
  Top 0.406: LDO:IC3.4 31.04,41.25 29.4,39.61 LDO:IC3.1 29.4,37.75 C13.1 27.09,35.43 | v37.21,24.51 39.5,22.23 44.07,22.23 44.83,21.46 44.83,18.41 43.39,16.98 R18.2
  Bottom 0.305: v23.88,34.8 23.88,30.78 25.24,29.42 27.23,29.42 31.56,25.08 31.56,24.45 32.64,23.37 36.07,23.37 v37.21,24.51
VS_2.5V_OUT  (via drill 0.35, 0.45)
  Top 0.254: v39.38,25.24 39.38,24.63 v40.26,23.75
  Top 0.406: LDO:IC2.1 21.05,41.34 22.71,39.67 LDO:IC2.4 22.73,39.42 v22.73,37.85 | v35.69,30.61 29.84,30.61 v28.57,31.88
  Top 0.508: 2.5V.1 19.68,43.72 17.3,41.34
  Top 0.61: LDO:IC2.1 17.3,41.34
  Top 0.813: 17.3,41.34 C12.1
  Bottom 0.152: 28.57,32 v28.57,31.88
  Bottom 0.254: AF:C5.1 39.38,26.06 v39.38,25.24 | AF:IC1.5 40.64,23.37 v40.26,23.75
  Bottom 0.406: TT:C3.1 39.92,30.65 41.91,32.64 TT:IC2.3 | TT:C3.1 37.59,28.36 AF:C2.1 38.15,26.45 AF:C5.1 | TT:C3.1 37.55,30.61 v35.69,30.61 | v22.73,37.85 28.57,32
  Bottom 0.813: AF:C6.2 48.65,26.38 48.18,25.91 AF:IC1.2 45.47,25.91 42.93,23.37 AF:IC1.5
VS_5V
  Top 0.406: LDO:R8.2 37.67,43.73 LDO:R7.2 34.62,45.17 LDO:R12.1
  Top 0.61: LDO:R12.1 33.02,45.55 30.7,47.88 28.15,47.88
  Top 0.889: R9.1 28.15,47.88
VS_5V_BACKUP  (via drill 0.65)
  Top 0.152: 29.97,45.47 LDO:R11.1
  Top 0.61: v23.11,56.9 23.75,56.26 R13.2 24.63,55.08 25.4,54.31 v25.4,50.42 | v29.59,46.74 29.97,46.36 29.97,45.47
  Bottom 0.508: 21.88,63.37 24.09,63.37 25.24,64.53 IC1.1 | R3.2 21.88,63.37 | 21.88,63.37 21.88,61.38 5V_BACKUP.1
  Bottom 0.61: IC1.1 25.68,62.68 25.61,62.61 23.49,60.5 23.49,57.28 v23.11,56.9 | v25.4,50.42 25.78,50.42 26.92,49.28 28.07,49.28 29.59,47.75 v29.59,46.74
  Bottom 0.813: 25.61,62.61 25.61,62.44 C5.1
VS_5V_OUT  (via drill 0.35, 0.45, 0.55)
  Top 0.406: R24.2 20.79,51.98 19.3,53.47 5V.1 | TT:IC1.5 34.27,41.51 33.02,40.26 v33.02,39.75 | C11.1 26.71,45.3 v27.3,44.7 | v41.02,29.08 40.64,29.46 v35.31,29.46 35.18,29.34 35.18,24.64 38.73,21.08 | 38.73,21.08 40.93,21.08 AF:C1.1 | v43.31,19.18 40.64,19.18 38.73,21.08
  Top 0.508: v25.7,30.25 24.13,28.69 v24.13,16.51 22.35,14.73 v22.35,13.84 | v22.35,13.84 v22.35,9.65 | v22.35,13.84 21.84,13.33 12.19,13.33 v10.54,14.99
  Top 0.61: C11.1 25.31,45.39 25.31,47.12 25.69,47.5 R9.2 23.37,50.2 23.37,52.87
  Top 0.813: R24.2 23.37,52.87 23.75,53.25 R13.1
  Bottom 0.152: 20.01,7.31 L1.2 | v10.54,14.99 10.45,15.07 | 40.27,26.66 40.25,26.68
  Bottom 0.406: v27.3,44.7 29.59,42.42 31.11,42.42 33.02,40.51 v33.02,39.75 TT:R1.2 31.5,36.66 31.5,34.71 TT:C2.1 31.15,33.02 TT:C1.1 31.15,29.68 32.98,27.86 R17.1 34.58,29.46 v35.31,29.46 | 40.27,26.66 41.02,25.91 AF:IC1.7 | U1.4 12.13,21.06 C8.1 10.92,18.8 10.45,18.33 C1.1 | AF:IC2.5 44.79,19.18 v43.31,19.18 | v41.02,29.08 40.25,28.31 40.25,26.68
  Bottom 0.508: TT:C1.1 29.63,31.62 28.87,30.86 26.3,30.86 v25.7,30.25 | v22.35,13.84 24.09,12.1 R6.2 | v22.35,9.65 20.01,7.31 | 10.45,15.07 C1.1 | v24.13,16.51 25.57,16.51 R5.2
  Bottom 0.61: R6.2 26.8,12.1 27.39,12.7 J1.02
VS_6V
  Top 0.152: 34.88,58.41 34.79,58.5
  Top 0.381: 40.87,76.14 BK:L1.2
  Top 0.508: 6V.1 43.73,73.28 40.87,76.14 | BK:L1.2 40.87,76.69 40.64,76.45
  Top 0.813: R2.1 35.81,57.48 34.88,58.41 | BG:IC1.5 44.1,66.08 43.04,65.02 BG:R1.2 41.11,64.48 38.8,62.16 35.43,62.16 34.79,61.53 | BG:Q1.1 34.79,61.53 | 34.79,58.5 34.79,61.53
  Top 1.016: 40.64,76.45 40.64,73.19 BK:R1.2 38.95,70.41 R1.1 39.18,69.56 40.88,67.86 BK:C2.1 41.15,66.97 41.15,65.06 BG:R1.2
VS_9V
  Top 0.152: BK:IC1.2 25.72,73.11
  Top 1.016: BK:S1.1 15.37,76.8 18.7,73.46 F11.2 19.59,73.49 BK:C1.1 22.1,73.11 25.72,73.11

### Text on the board
tNames: Backup 5V | Our 5V | V_BG | GND | V_TH | VS_2.5V_OUT | V_TP | RST | MOSI | MISO | SCK | GND | GND | 5V | SCL | SDA